# EAGLE design led (EAGLE 9.6.1)
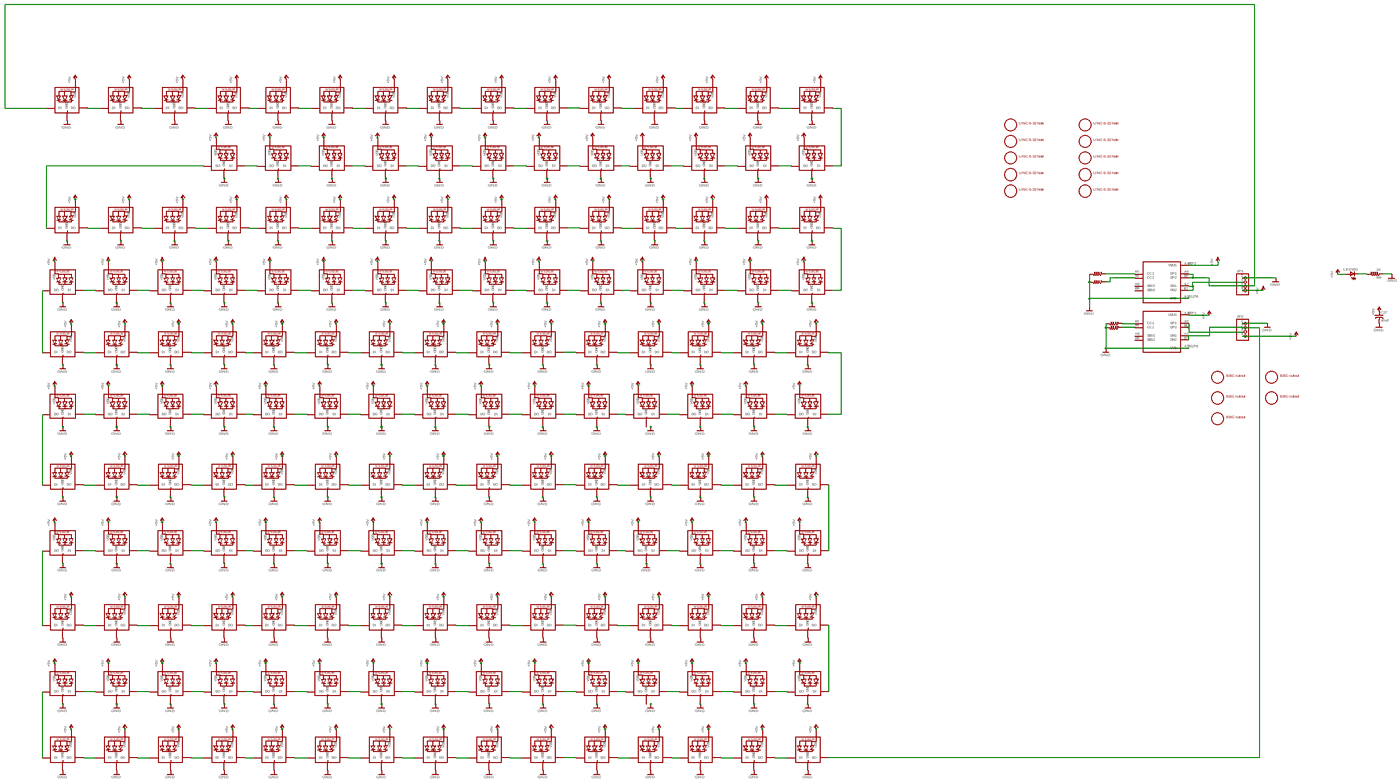
[diagram p0: schematic, sheet 1, overview]
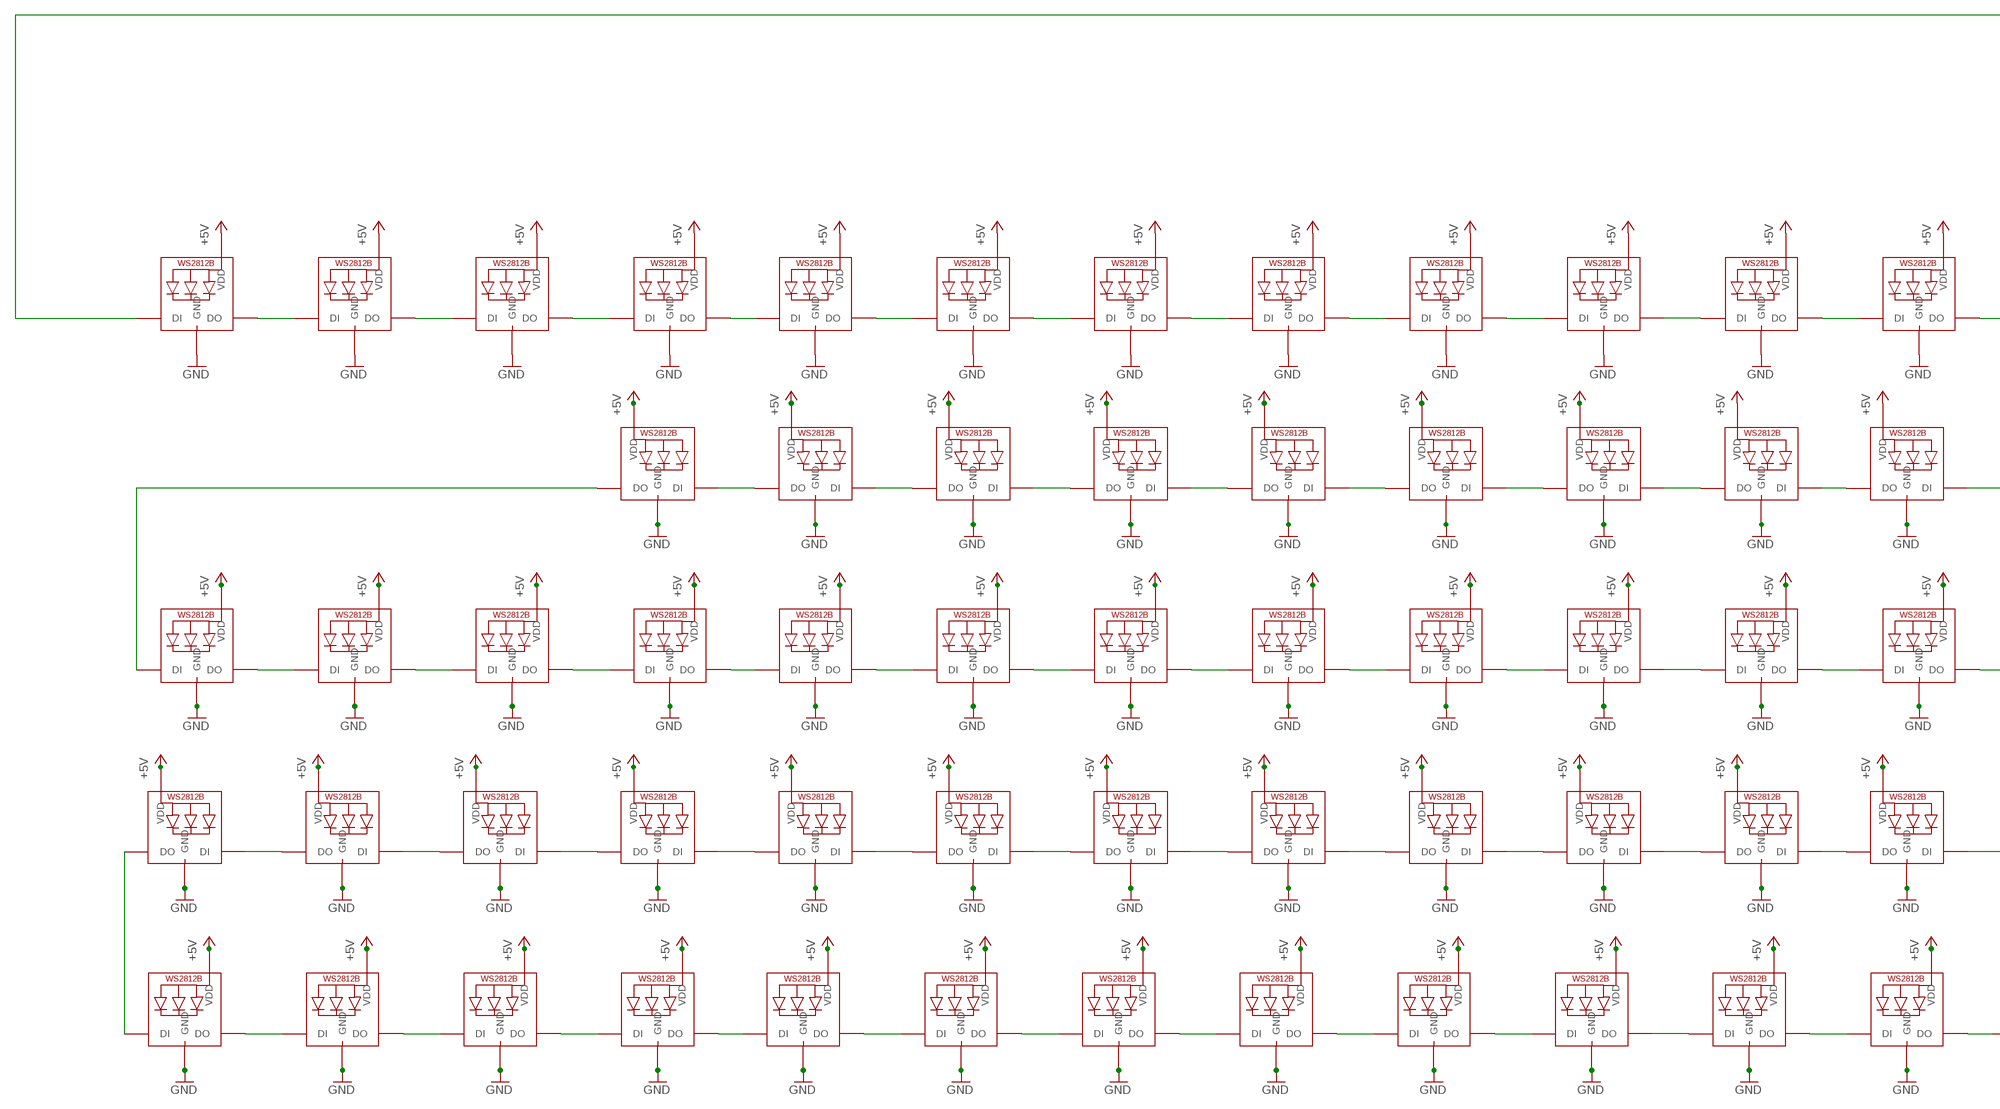
[diagram p1: schematic, sheet 1, part 1 of 4]
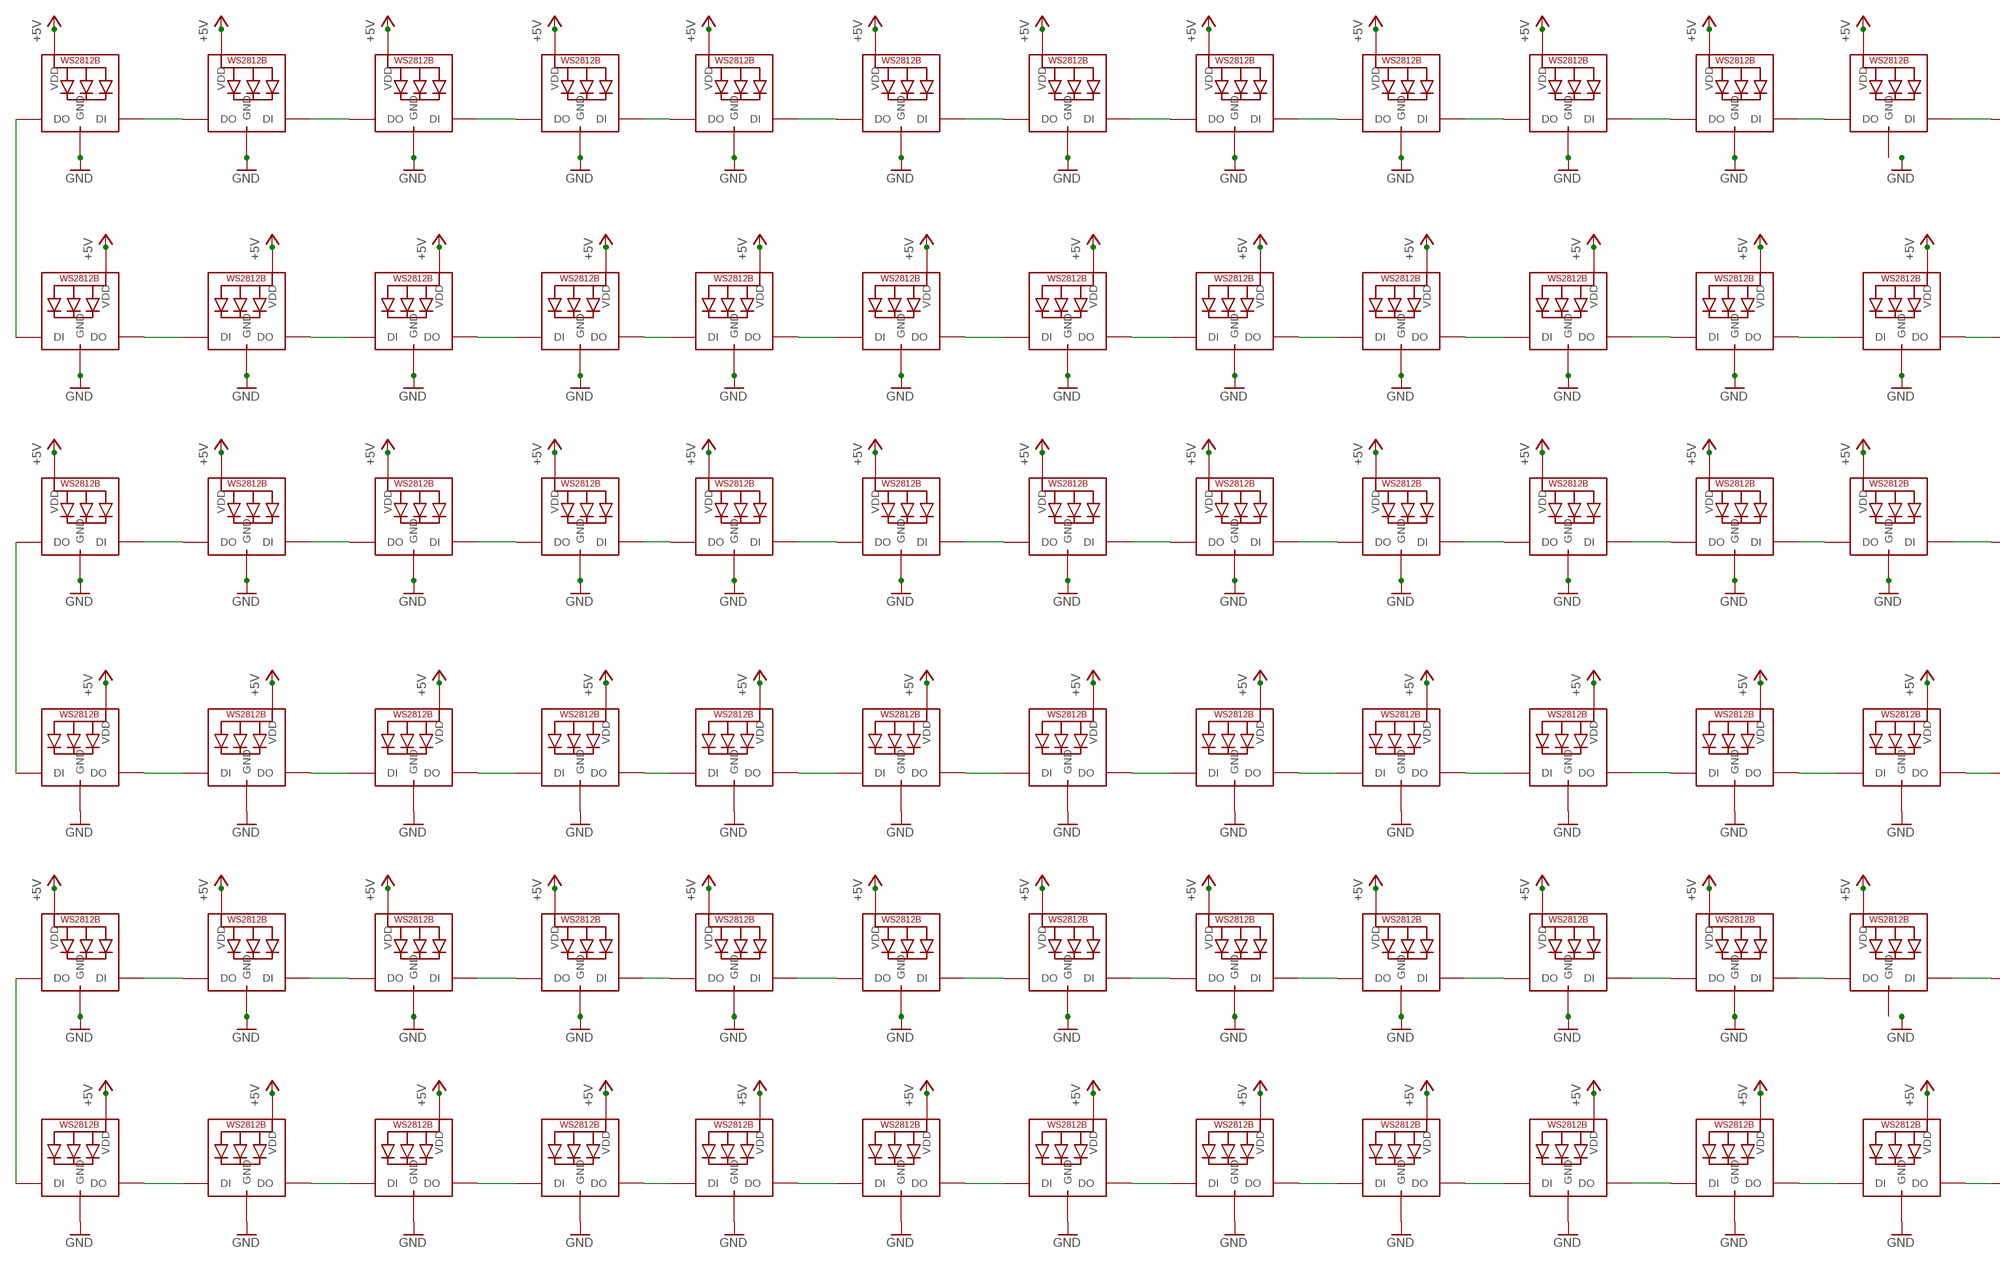
[diagram p2: schematic, sheet 1, part 2 of 4]
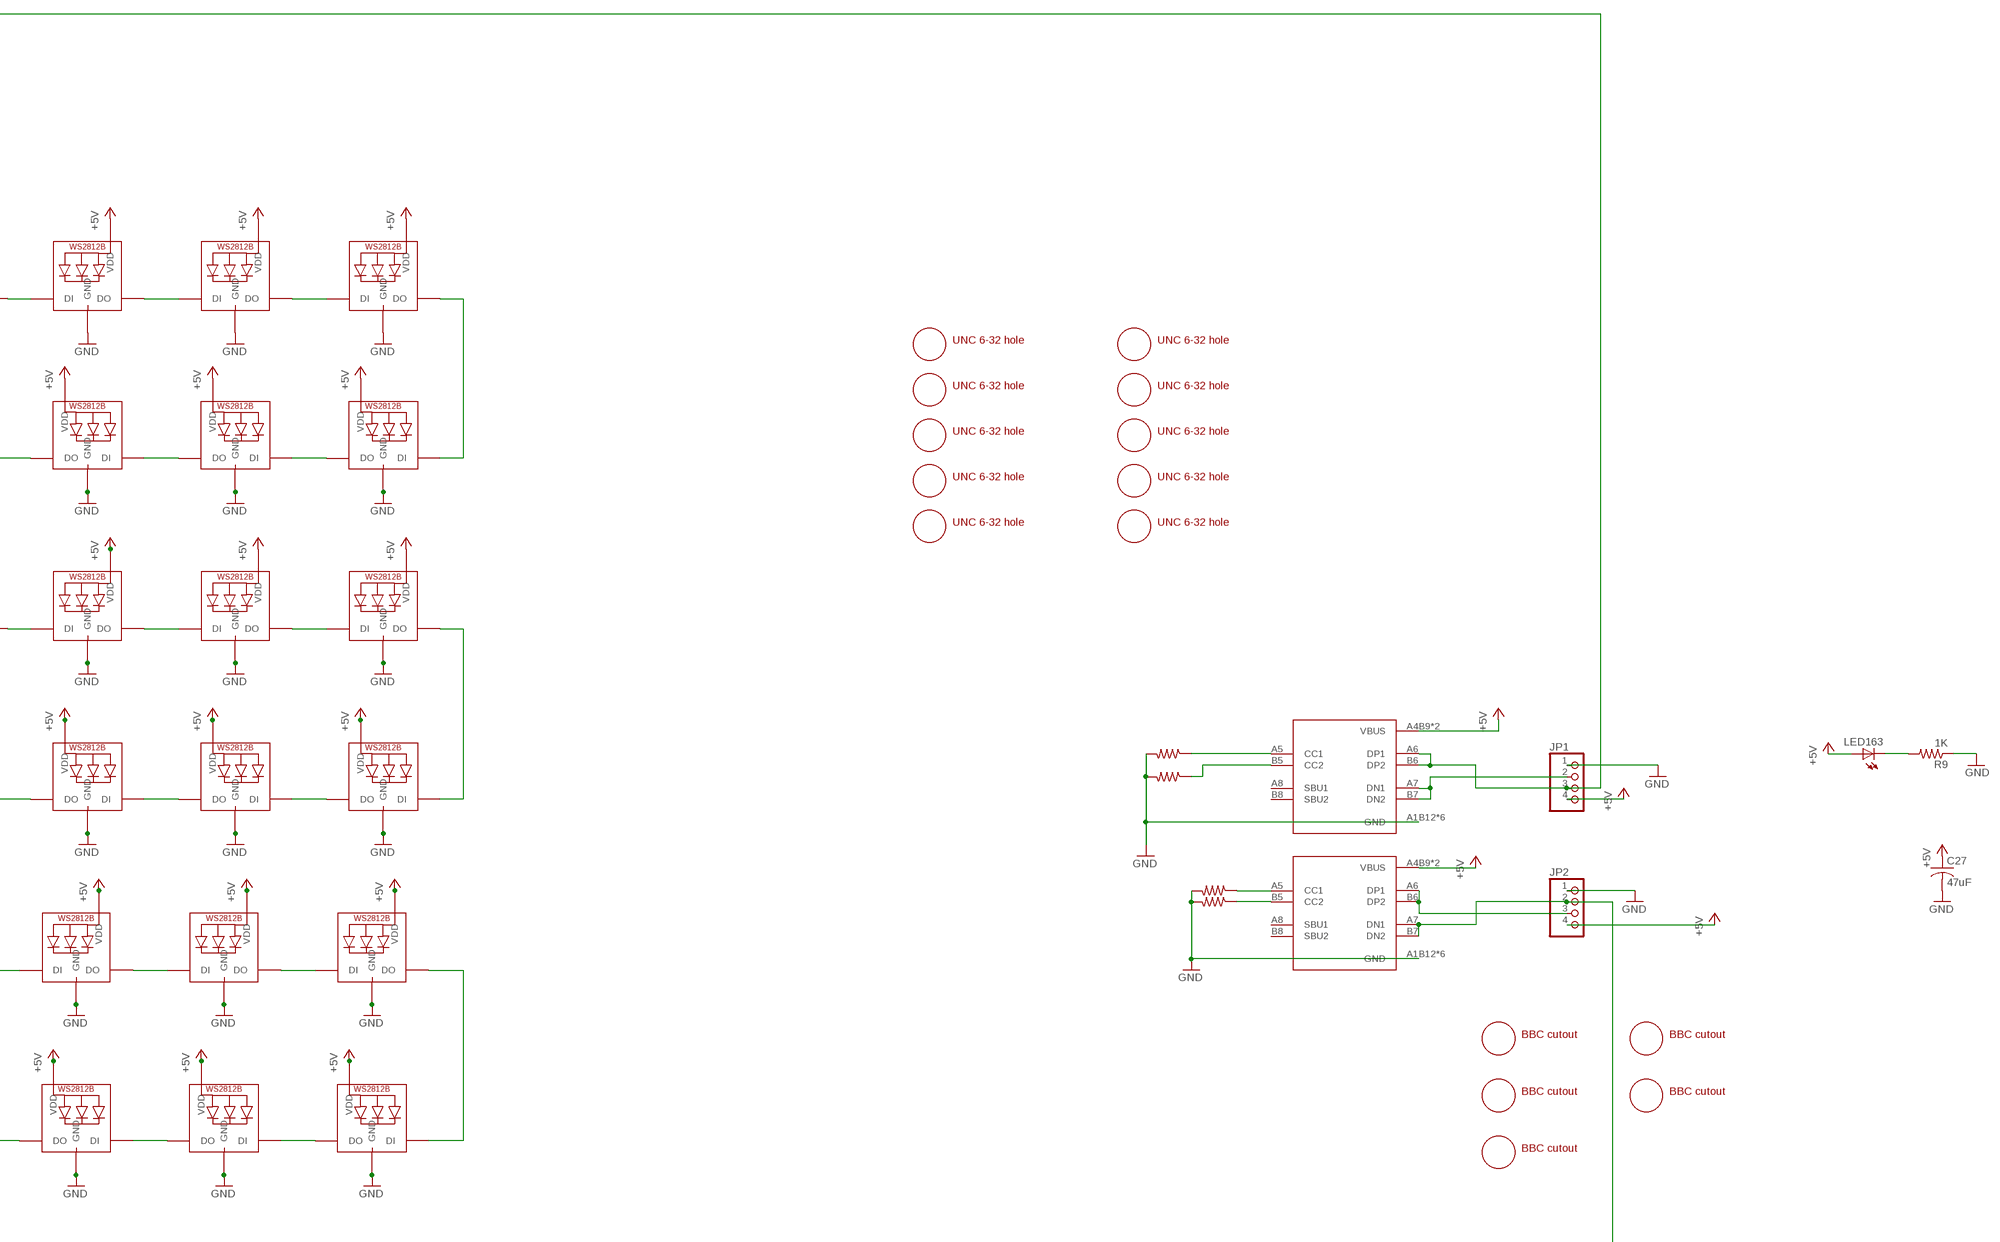
[diagram p3: schematic, sheet 1, part 3 of 4]
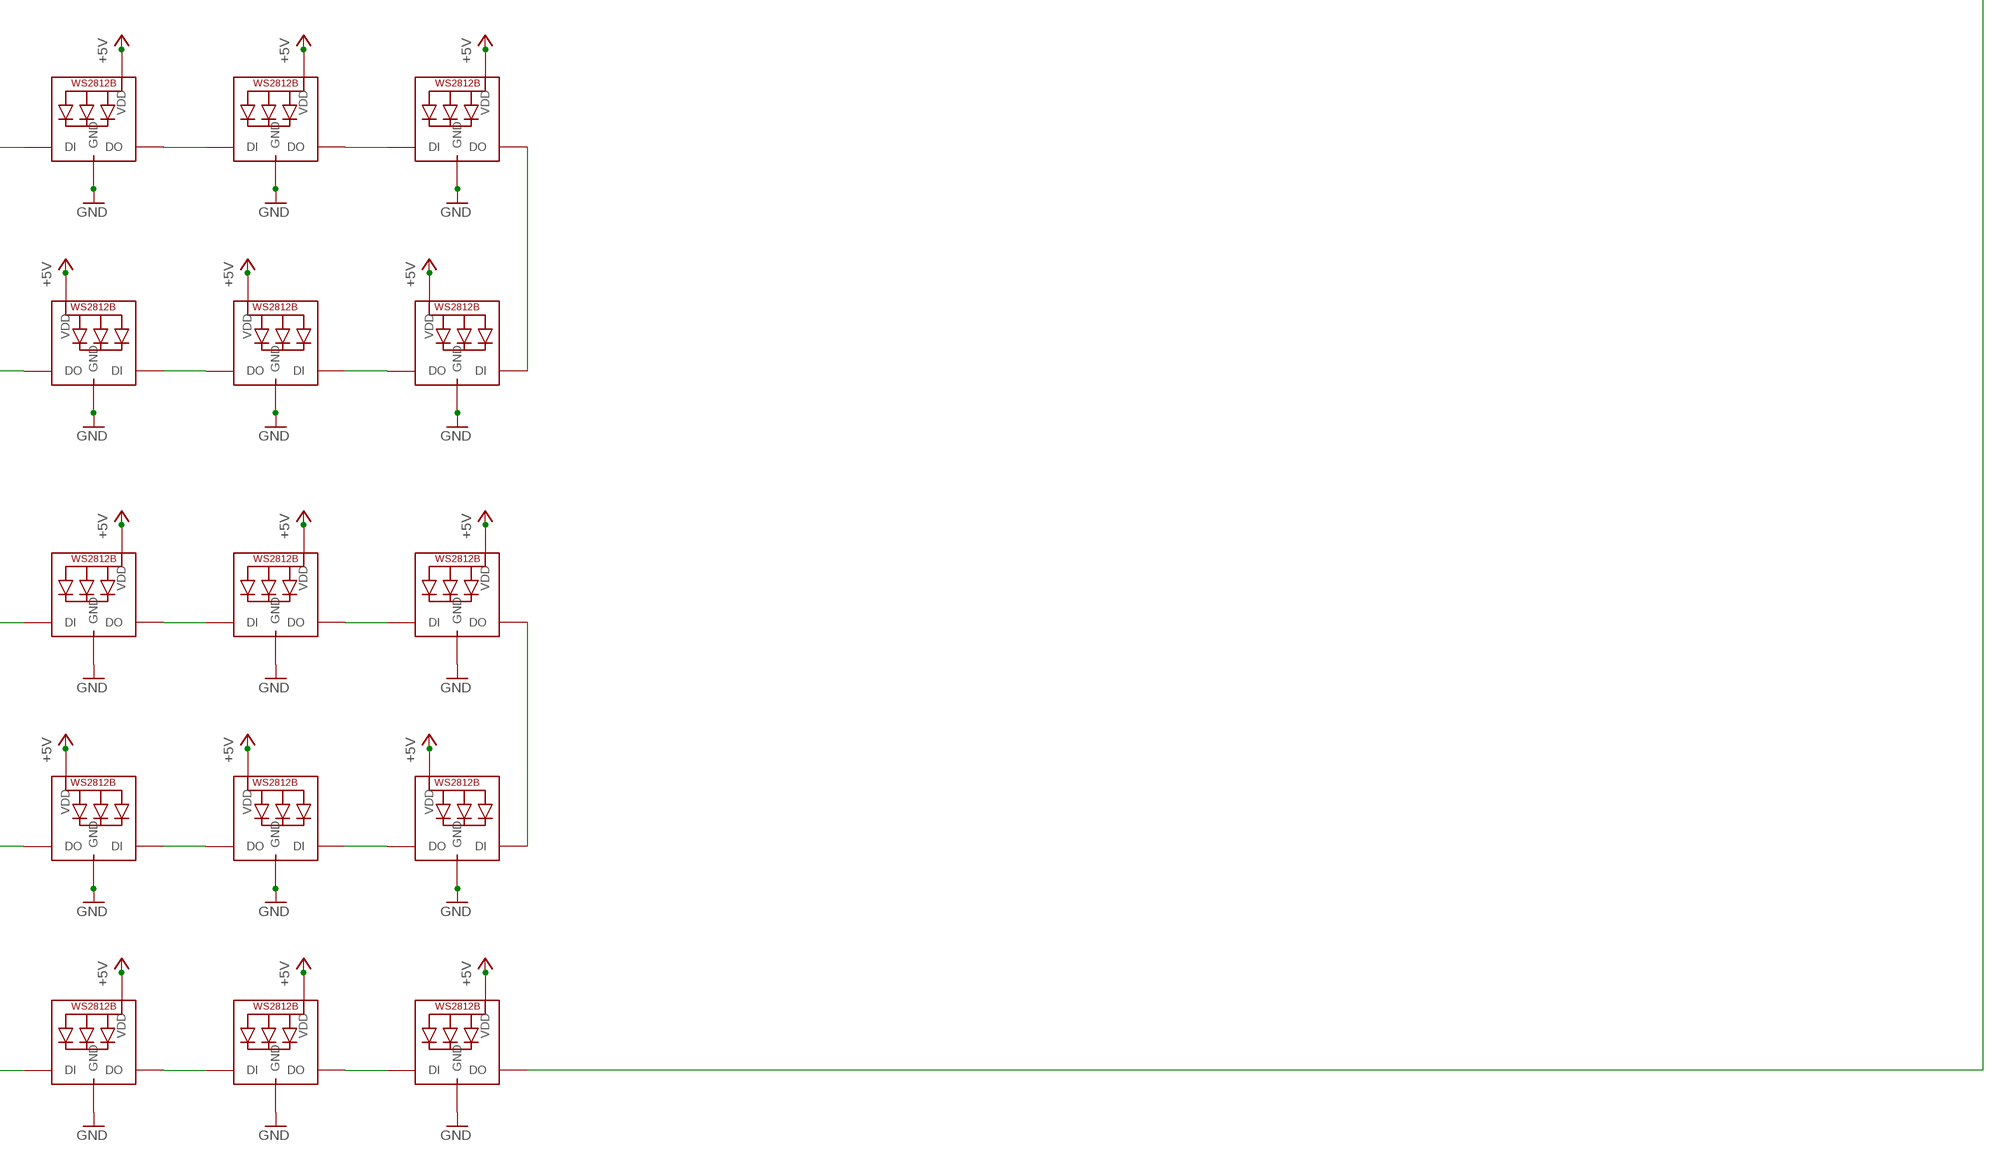
[diagram p4: schematic, sheet 1, part 4 of 4]

## Parts
C27  47uF  C-USC1210  [C1210]
JP1  PINHD-1X4  [1X04]
JP2  PINHD-1X4  [1X04]
LED1  WS2812B  [REVERSE_MNT]
LED2  WS2812B  [REVERSE_MNT]
LED3  WS2812B  [REVERSE_MNT]
LED4  WS2812B  [REVERSE_MNT]
LED5  WS2812B  [REVERSE_MNT]
LED6  WS2812B  [REVERSE_MNT]
LED7  WS2812B  [REVERSE_MNT]
LED8  WS2812B  [REVERSE_MNT]
LED9  WS2812B  [REVERSE_MNT]
LED10  WS2812B  [REVERSE_MNT]
LED11  WS2812B  [REVERSE_MNT]
LED12  WS2812B  [REVERSE_MNT]
LED13  WS2812B  [REVERSE_MNT]
LED14  WS2812B  [REVERSE_MNT]
LED15  WS2812B  [REVERSE_MNT]
LED16  WS2812B  [REVERSE_MNT]
LED17  WS2812B  [REVERSE_MNT]
LED18  WS2812B  [REVERSE_MNT]
LED19  WS2812B  [REVERSE_MNT]
LED20  WS2812B  [REVERSE_MNT]
LED21  WS2812B  [REVERSE_MNT]
LED22  WS2812B  [REVERSE_MNT]
LED23  WS2812B  [REVERSE_MNT]
LED24  WS2812B  [REVERSE_MNT]
LED25  WS2812B  [REVERSE_MNT]
LED26  WS2812B  [REVERSE_MNT]
LED27  WS2812B  [REVERSE_MNT]
LED28  WS2812B  [REVERSE_MNT]
LED29  WS2812B  [REVERSE_MNT]
LED30  WS2812B  [REVERSE_MNT]
LED31  WS2812B  [REVERSE_MNT]
LED32  WS2812B  [REVERSE_MNT]
LED33  WS2812B  [REVERSE_MNT]
LED34  WS2812B  [REVERSE_MNT]
LED35  WS2812B  [REVERSE_MNT]
LED36  WS2812B  [REVERSE_MNT]
LED37  WS2812B  [REVERSE_MNT]
LED38  WS2812B  [REVERSE_MNT]
LED39  WS2812B  [REVERSE_MNT]
LED40  WS2812B  [REVERSE_MNT]
LED41  WS2812B  [REVERSE_MNT]
LED42  WS2812B  [REVERSE_MNT]
LED43  WS2812B  [REVERSE_MNT]
LED44  WS2812B  [REVERSE_MNT]
LED45  WS2812B  [REVERSE_MNT]
LED46  WS2812B  [REVERSE_MNT]
LED47  WS2812B  [REVERSE_MNT]
LED48  WS2812B  [REVERSE_MNT]
LED49  WS2812B  [REVERSE_MNT]
LED50  WS2812B  [REVERSE_MNT]
LED51  WS2812B  [REVERSE_MNT]
LED52  WS2812B  [REVERSE_MNT]
LED53  WS2812B  [REVERSE_MNT]
LED54  WS2812B  [REVERSE_MNT]
LED55  WS2812B  [REVERSE_MNT]
LED56  WS2812B  [REVERSE_MNT]
LED57  WS2812B  [REVERSE_MNT]
LED58  WS2812B  [REVERSE_MNT]
LED59  WS2812B  [REVERSE_MNT]
LED60  WS2812B  [REVERSE_MNT]
LED61  WS2812B  [REVERSE_MNT]
LED62  WS2812B  [REVERSE_MNT]
LED63  WS2812B  [REVERSE_MNT]
LED64  WS2812B  [REVERSE_MNT]
LED65  WS2812B  [REVERSE_MNT]
LED66  WS2812B  [REVERSE_MNT]
LED67  WS2812B  [REVERSE_MNT]
LED68  WS2812B  [REVERSE_MNT]
LED69  WS2812B  [REVERSE_MNT]
LED70  WS2812B  [REVERSE_MNT]
LED71  WS2812B  [REVERSE_MNT]
LED72  WS2812B  [REVERSE_MNT]
LED73  WS2812B  [REVERSE_MNT]
LED74  WS2812B  [REVERSE_MNT]
LED75  WS2812B  [REVERSE_MNT]
LED76  WS2812B  [REVERSE_MNT]
LED77  WS2812B  [REVERSE_MNT]
LED78  WS2812B  [REVERSE_MNT]
LED79  WS2812B  [REVERSE_MNT]
LED80  WS2812B  [REVERSE_MNT]
LED81  WS2812B  [REVERSE_MNT]
LED82  WS2812B  [REVERSE_MNT]
LED83  WS2812B  [REVERSE_MNT]
LED84  WS2812B  [REVERSE_MNT]
LED85  WS2812B  [REVERSE_MNT]
LED86  WS2812B  [REVERSE_MNT]
LED87  WS2812B  [REVERSE_MNT]
LED88  WS2812B  [REVERSE_MNT]
LED89  WS2812B  [REVERSE_MNT]
LED90  WS2812B  [REVERSE_MNT]
LED91  WS2812B  [REVERSE_MNT]
LED92  WS2812B  [REVERSE_MNT]
LED93  WS2812B  [REVERSE_MNT]
LED94  WS2812B  [REVERSE_MNT]
LED95  WS2812B  [REVERSE_MNT]
LED96  WS2812B  [REVERSE_MNT]
LED97  WS2812B  [REVERSE_MNT]
LED98  WS2812B  [REVERSE_MNT]
LED99  WS2812B  [REVERSE_MNT]
LED100  WS2812B  [REVERSE_MNT]
LED101  WS2812B  [REVERSE_MNT]
LED102  WS2812B  [REVERSE_MNT]
LED103  WS2812B  [REVERSE_MNT]
LED104  WS2812B  [REVERSE_MNT]
LED105  WS2812B  [REVERSE_MNT]
LED106  WS2812B  [REVERSE_MNT]
LED107  WS2812B  [REVERSE_MNT]
LED108  WS2812B  [REVERSE_MNT]
LED109  WS2812B  [REVERSE_MNT]
LED110  WS2812B  [REVERSE_MNT]
LED111  WS2812B  [REVERSE_MNT]
LED112  WS2812B  [REVERSE_MNT]
LED113  WS2812B  [REVERSE_MNT]
LED114  WS2812B  [REVERSE_MNT]
LED115  WS2812B  [REVERSE_MNT]
LED116  WS2812B  [REVERSE_MNT]
LED117  WS2812B  [REVERSE_MNT]
LED118  WS2812B  [REVERSE_MNT]
LED119  WS2812B  [REVERSE_MNT]
LED120  WS2812B  [REVERSE_MNT]
LED121  WS2812B  [REVERSE_MNT]
LED122  WS2812B  [REVERSE_MNT]
LED123  WS2812B  [REVERSE_MNT]
LED124  WS2812B  [REVERSE_MNT]
LED125  WS2812B  [REVERSE_MNT]
LED126  WS2812B  [REVERSE_MNT]
LED127  WS2812B  [REVERSE_MNT]
LED128  WS2812B  [REVERSE_MNT]
LED129  WS2812B  [REVERSE_MNT]
LED130  WS2812B  [REVERSE_MNT]
LED131  WS2812B  [REVERSE_MNT]
LED132  WS2812B  [REVERSE_MNT]
LED133  WS2812B  [REVERSE_MNT]
LED134  WS2812B  [REVERSE_MNT]
LED135  WS2812B  [REVERSE_MNT]
LED136  WS2812B  [REVERSE_MNT]
LED137  WS2812B  [REVERSE_MNT]
LED138  WS2812B  [REVERSE_MNT]
LED139  WS2812B  [REVERSE_MNT]
LED140  WS2812B  [REVERSE_MNT]
LED141  WS2812B  [REVERSE_MNT]
LED142  WS2812B  [REVERSE_MNT]
LED143  WS2812B  [REVERSE_MNT]
LED144  WS2812B  [REVERSE_MNT]
LED145  WS2812B  [REVERSE_MNT]
LED146  WS2812B  [REVERSE_MNT]
LED147  WS2812B  [REVERSE_MNT]
LED148  WS2812B  [REVERSE_MNT]
LED149  WS2812B  [REVERSE_MNT]
LED150  WS2812B  [REVERSE_MNT]
LED151  WS2812B  [REVERSE_MNT]
LED152  WS2812B  [REVERSE_MNT]
LED153  WS2812B  [REVERSE_MNT]
LED154  WS2812B  [REVERSE_MNT]
LED155  WS2812B  [REVERSE_MNT]
LED156  WS2812B  [REVERSE_MNT]
LED157  WS2812B  [REVERSE_MNT]
LED158  WS2812B  [REVERSE_MNT]
LED159  WS2812B  [REVERSE_MNT]
LED160  WS2812B  [REVERSE_MNT]
LED161  WS2812B  [REVERSE_MNT]
LED162  WS2812B  [REVERSE_MNT]
LED163  LEDCHIP-LED0805  [CHIP-LED0805]
R1  5.1K  RESISTOR0805-RES  [0805]
R2  5.1K  RESISTOR0805-RES  [0805]
R3  5.1K  RESISTOR0805-RES  [0805]
R4  5.1K  RESISTOR0805-RES  [0805]
R9  1K  RESISTOR0805-RES  [0805]
U1  USBC_16P  [USBC_16P_FOOT]
U2  USBC_16P  [USBC_16P_FOOT]
U$1  MOTHERBOARD_MOUNTING_HOLE  [MOTEHRBOARD_MOUNTING_HOLE]
U$2  MOTHERBOARD_MOUNTING_HOLE  [MOTEHRBOARD_MOUNTING_HOLE]
U$3  MOTHERBOARD_MOUNTING_HOLE  [MOTEHRBOARD_MOUNTING_HOLE]
U$4  MOTHERBOARD_MOUNTING_HOLE  [MOTEHRBOARD_MOUNTING_HOLE]
U$5  MOTHERBOARD_MOUNTING_HOLE  [MOTEHRBOARD_MOUNTING_HOLE]
U$6  MOTHERBOARD_MOUNTING_HOLE  [MOTEHRBOARD_MOUNTING_HOLE]
U$7  MOTHERBOARD_MOUNTING_HOLE  [MOTEHRBOARD_MOUNTING_HOLE]
U$8  MOTHERBOARD_MOUNTING_HOLE  [MOTEHRBOARD_MOUNTING_HOLE]
U$9  MOTHERBOARD_MOUNTING_HOLE  [MOTEHRBOARD_MOUNTING_HOLE]
U$10  MOTHERBOARD_MOUNTING_HOLE  [MOTEHRBOARD_MOUNTING_HOLE]
U$11  BBC_CUTOUT  [BBC_MOUNTING_HOLE_CUTOUT]
U$12  BBC_CUTOUT  [BBC_MOUNTING_HOLE_CUTOUT]
U$13  BBC_CUTOUT  [BBC_MOUNTING_HOLE_CUTOUT]
U$14  BBC_CUTOUT  [BBC_MOUNTING_HOLE_CUTOUT]
U$15  BBC_CUTOUT  [BBC_MOUNTING_HOLE_CUTOUT]

## Nets
+5V: C27.1 JP1.4 JP2.4 LED1.VDD LED2.VDD LED3.VDD LED4.VDD LED5.VDD LED6.VDD LED7.VDD LED8.VDD LED9.VDD LED10.VDD LED11.VDD LED12.VDD LED13.VDD LED14.VDD LED15.VDD LED16.VDD LED17.VDD LED18.VDD LED19.VDD LED20.VDD LED21.VDD LED22.VDD LED23.VDD LED24.VDD LED25.VDD LED26.VDD LED27.VDD LED28.VDD LED29.VDD LED30.VDD LED31.VDD LED32.VDD LED33.VDD LED34.VDD LED35.VDD LED36.VDD LED37.VDD LED38.VDD LED39.VDD LED40.VDD LED41.VDD LED42.VDD LED43.VDD LED44.VDD LED45.VDD LED46.VDD LED47.VDD LED48.VDD LED49.VDD LED50.VDD LED51.VDD LED52.VDD LED53.VDD LED54.VDD LED55.VDD LED56.VDD LED57.VDD LED58.VDD LED59.VDD LED60.VDD LED61.VDD LED62.VDD LED63.VDD LED64.VDD LED65.VDD LED66.VDD LED67.VDD LED68.VDD LED69.VDD LED70.VDD LED71.VDD LED72.VDD LED73.VDD LED74.VDD LED75.VDD LED76.VDD LED77.VDD LED78.VDD LED79.VDD LED80.VDD LED81.VDD LED82.VDD LED83.VDD LED84.VDD LED85.VDD LED86.VDD LED87.VDD LED88.VDD LED89.VDD LED90.VDD LED91.VDD LED92.VDD LED93.VDD LED94.VDD LED95.VDD LED96.VDD LED97.VDD LED98.VDD LED99.VDD LED100.VDD LED101.VDD LED102.VDD LED103.VDD LED104.VDD LED105.VDD LED106.VDD LED107.VDD LED108.VDD LED109.VDD LED110.VDD LED111.VDD LED112.VDD LED113.VDD LED114.VDD LED115.VDD LED116.VDD LED117.VDD LED118.VDD LED119.VDD LED120.VDD LED121.VDD LED122.VDD LED123.VDD LED124.VDD LED125.VDD LED126.VDD LED127.VDD LED128.VDD LED129.VDD LED130.VDD LED131.VDD LED132.VDD LED133.VDD LED134.VDD LED135.VDD LED136.VDD LED137.VDD LED138.VDD LED139.VDD LED140.VDD LED141.VDD LED142.VDD LED143.VDD LED144.VDD LED145.VDD LED146.VDD LED147.VDD LED148.VDD LED149.VDD LED150.VDD LED151.VDD LED152.VDD LED153.VDD LED154.VDD LED155.VDD LED156.VDD LED157.VDD LED158.VDD LED159.VDD LED160.VDD LED161.VDD LED162.VDD LED163.A U1.A4B9(VBUS) U1.B4A9(VBUS) U2.A4B9(VBUS) U2.B4A9(VBUS)
GND: C27.2 JP1.1 JP2.1 LED1.GND LED2.GND LED3.GND LED4.GND LED5.GND LED6.GND LED7.GND LED8.GND LED9.GND LED10.GND LED11.GND LED12.GND LED13.GND LED14.GND LED15.GND LED16.GND LED17.GND LED18.GND LED19.GND LED20.GND LED21.GND LED22.GND LED23.GND LED24.GND LED25.GND LED26.GND LED27.GND LED28.GND LED29.GND LED30.GND LED31.GND LED32.GND LED33.GND LED34.GND LED35.GND LED36.GND LED37.GND LED38.GND LED39.GND LED40.GND LED41.GND LED42.GND LED43.GND LED44.GND LED45.GND LED46.GND LED47.GND LED48.GND LED49.GND LED50.GND LED51.GND LED52.GND LED53.GND LED54.GND LED55.GND LED56.GND LED57.GND LED58.GND LED59.GND LED60.GND LED61.GND LED62.GND LED63.GND LED64.GND LED65.GND LED66.GND LED67.GND LED68.GND LED69.GND LED70.GND LED71.GND LED72.GND LED73.GND LED74.GND LED75.GND LED77.GND LED78.GND LED79.GND LED80.GND LED81.GND LED82.GND LED83.GND LED84.GND LED85.GND LED86.GND LED87.GND LED88.GND LED89.GND LED90.GND LED91.GND LED92.GND LED93.GND LED94.GND LED95.GND LED96.GND LED97.GND LED98.GND LED99.GND LED100.GND LED101.GND LED102.GND LED103.GND LED104.GND LED105.GND LED106.GND LED107.GND LED108.GND LED109.GND LED110.GND LED111.GND LED112.GND LED113.GND LED114.GND LED115.GND LED116.GND LED117.GND LED118.GND LED119.GND LED120.GND LED121.GND LED122.GND LED123.GND LED124.GND LED125.GND LED126.GND LED127.GND LED128.GND LED129.GND LED130.GND LED131.GND LED132.GND LED133.GND LED134.GND LED135.GND LED137.GND LED138.GND LED139.GND LED140.GND LED141.GND LED142.GND LED143.GND LED144.GND LED145.GND LED146.GND LED147.GND LED148.GND LED149.GND LED150.GND LED151.GND LED152.GND LED153.GND LED154.GND LED155.GND LED156.GND LED157.GND LED158.GND LED159.GND LED160.GND LED161.GND LED162.GND R1.2 R2.2 R3.2 R4.2 R9.1 U1.A1B12(GND) U1.B11A12(GND) U1.P$13(GND) U1.P$14(GND) U1.P$15(GND) U1.P$16(GND) U2.A1B12(GND) U2.B11A12(GND) U2.P$13(GND) U2.P$14(GND) U2.P$15(GND) U2.P$16(GND)
N$1: LED1.DOUT(DO) LED2.DIN(DI)
N$2: LED2.DOUT(DO) LED3.DIN(DI)
N$3: LED3.DOUT(DO) LED4.DIN(DI)
N$4: LED4.DOUT(DO) LED5.DIN(DI)
N$5: LED5.DOUT(DO) LED6.DIN(DI)
N$6: LED6.DOUT(DO) LED7.DIN(DI)
N$7: R3.1 U1.A5(CC1)
N$8: LED8.DOUT(DO) LED9.DIN(DI)
N$9: LED9.DOUT(DO) LED10.DIN(DI)
N$10: LED10.DOUT(DO) LED11.DIN(DI)
N$11: LED11.DOUT(DO) LED12.DIN(DI)
N$12: LED12.DOUT(DO) LED13.DIN(DI)
N$13: LED13.DOUT(DO) LED14.DIN(DI)
N$14: LED14.DOUT(DO) LED15.DIN(DI)
N$15: LED15.DOUT(DO) LED16.DIN(DI)
N$16: LED16.DOUT(DO) LED17.DIN(DI)
N$17: LED17.DOUT(DO) LED18.DIN(DI)
N$18: LED18.DOUT(DO) LED19.DIN(DI)
N$19: LED19.DOUT(DO) LED20.DIN(DI)
N$20: LED20.DOUT(DO) LED21.DIN(DI)
N$21: LED21.DOUT(DO) LED22.DIN(DI)
N$22: LED22.DOUT(DO) LED23.DIN(DI)
N$23: LED23.DOUT(DO) LED24.DIN(DI)
N$24: LED24.DOUT(DO) LED25.DIN(DI)
N$25: LED25.DOUT(DO) LED26.DIN(DI)
N$26: LED26.DOUT(DO) LED27.DIN(DI)
N$27: LED28.DOUT(DO) LED29.DIN(DI)
N$28: LED29.DOUT(DO) LED30.DIN(DI)
N$29: LED30.DOUT(DO) LED31.DIN(DI)
N$30: LED31.DOUT(DO) LED32.DIN(DI)
N$31: R1.1 U2.B5(CC2)
N$32: LED32.DOUT(DO) LED33.DIN(DI)
N$33: R2.1 U2.A5(CC1)
N$34: LED33.DOUT(DO) LED34.DIN(DI)
N$35: LED34.DOUT(DO) LED35.DIN(DI)
N$36: LED35.DOUT(DO) LED36.DIN(DI)
N$37: LED36.DOUT(DO) LED37.DIN(DI)
N$38: LED37.DOUT(DO) LED38.DIN(DI)
N$39: LED38.DOUT(DO) LED39.DIN(DI)
N$40: LED39.DOUT(DO) LED40.DIN(DI)
N$41: LED40.DOUT(DO) LED41.DIN(DI)
N$42: LED41.DOUT(DO) LED42.DIN(DI)
N$43: LED42.DOUT(DO) LED43.DIN(DI)
N$44: LED27.DOUT(DO) LED28.DIN(DI)
N$45: LED54.DOUT(DO) LED55.DIN(DI)
N$46: LED43.DOUT(DO) LED44.DIN(DI)
N$47: LED44.DOUT(DO) LED45.DIN(DI)
N$48: LED45.DOUT(DO) LED46.DIN(DI)
N$49: LED46.DOUT(DO) LED47.DIN(DI)
N$50: LED47.DOUT(DO) LED48.DIN(DI)
N$51: LED48.DOUT(DO) LED49.DIN(DI)
N$52: LED49.DOUT(DO) LED50.DIN(DI)
N$53: LED50.DOUT(DO) LED51.DIN(DI)
N$54: LED51.DOUT(DO) LED52.DIN(DI)
N$55: LED52.DOUT(DO) LED53.DIN(DI)
N$56: LED53.DOUT(DO) LED54.DIN(DI)
N$57: LED55.DOUT(DO) LED56.DIN(DI)
N$58: LED56.DOUT(DO) LED57.DIN(DI)
N$59: LED58.DOUT(DO) LED59.DIN(DI)
N$60: LED59.DOUT(DO) LED60.DIN(DI)
N$61: LED60.DOUT(DO) LED61.DIN(DI)
N$62: LED61.DOUT(DO) LED62.DIN(DI)
N$63: LED62.DOUT(DO) LED63.DIN(DI)
N$64: LED63.DOUT(DO) LED64.DIN(DI)
N$65: LED64.DOUT(DO) LED65.DIN(DI)
N$66: LED65.DOUT(DO) LED66.DIN(DI)
N$67: LED66.DOUT(DO) LED67.DIN(DI)
N$68: LED67.DOUT(DO) LED68.DIN(DI)
N$69: LED68.DOUT(DO) LED69.DIN(DI)
N$70: LED69.DOUT(DO) LED70.DIN(DI)
N$71: LED70.DOUT(DO) LED71.DIN(DI)
N$72: LED71.DOUT(DO) LED72.DIN(DI)
N$73: LED57.DOUT(DO) LED58.DIN(DI)
N$74: LED73.DOUT(DO) LED74.DIN(DI)
N$75: LED74.DOUT(DO) LED75.DIN(DI)
N$76: LED75.DOUT(DO) LED76.DIN(DI)
N$77: LED76.DOUT(DO) LED77.DIN(DI)
N$78: LED77.DOUT(DO) LED78.DIN(DI)
N$79: LED78.DOUT(DO) LED79.DIN(DI)
N$80: LED79.DOUT(DO) LED80.DIN(DI)
N$81: LED80.DOUT(DO) LED81.DIN(DI)
N$82: LED81.DOUT(DO) LED82.DIN(DI)
N$83: LED82.DOUT(DO) LED83.DIN(DI)
N$84: LED83.DOUT(DO) LED84.DIN(DI)
N$85: LED84.DOUT(DO) LED85.DIN(DI)
N$86: LED85.DOUT(DO) LED86.DIN(DI)
N$87: LED86.DOUT(DO) LED87.DIN(DI)
N$88: LED72.DOUT(DO) LED73.DIN(DI)
N$89: LED88.DOUT(DO) LED89.DIN(DI)
N$90: LED89.DOUT(DO) LED90.DIN(DI)
N$91: LED90.DOUT(DO) LED91.DIN(DI)
N$92: LED91.DOUT(DO) LED92.DIN(DI)
N$93: LED92.DOUT(DO) LED93.DIN(DI)
N$94: LED93.DOUT(DO) LED94.DIN(DI)
N$95: LED94.DOUT(DO) LED95.DIN(DI)
N$96: LED95.DOUT(DO) LED96.DIN(DI)
N$97: LED96.DOUT(DO) LED97.DIN(DI)
N$98: LED97.DOUT(DO) LED98.DIN(DI)
N$99: LED98.DOUT(DO) LED99.DIN(DI)
N$100: LED99.DOUT(DO) LED100.DIN(DI)
N$101: LED100.DOUT(DO) LED101.DIN(DI)
N$102: LED101.DOUT(DO) LED102.DIN(DI)
N$103: LED87.DOUT(DO) LED88.DIN(DI)
N$104: LED103.DOUT(DO) LED104.DIN(DI)
N$105: LED104.DOUT(DO) LED105.DIN(DI)
N$106: LED105.DOUT(DO) LED106.DIN(DI)
N$107: LED106.DOUT(DO) LED107.DIN(DI)
N$108: LED107.DOUT(DO) LED108.DIN(DI)
N$109: LED108.DOUT(DO) LED109.DIN(DI)
N$110: LED109.DOUT(DO) LED110.DIN(DI)
N$111: LED110.DOUT(DO) LED111.DIN(DI)
N$112: LED111.DOUT(DO) LED112.DIN(DI)
N$113: LED112.DOUT(DO) LED113.DIN(DI)
N$114: LED113.DOUT(DO) LED114.DIN(DI)
N$115: LED114.DOUT(DO) LED115.DIN(DI)
N$116: LED115.DOUT(DO) LED116.DIN(DI)
N$117: LED116.DOUT(DO) LED117.DIN(DI)
N$118: LED102.DOUT(DO) LED103.DIN(DI)
N$119: LED118.DOUT(DO) LED119.DIN(DI)
N$120: LED119.DOUT(DO) LED120.DIN(DI)
N$121: LED120.DOUT(DO) LED121.DIN(DI)
N$122: LED121.DOUT(DO) LED122.DIN(DI)
N$123: LED122.DOUT(DO) LED123.DIN(DI)
N$124: LED123.DOUT(DO) LED124.DIN(DI)
N$125: LED124.DOUT(DO) LED125.DIN(DI)
N$126: LED125.DOUT(DO) LED126.DIN(DI)
N$127: LED126.DOUT(DO) LED127.DIN(DI)
N$128: LED127.DOUT(DO) LED128.DIN(DI)
N$129: LED128.DOUT(DO) LED129.DIN(DI)
N$130: LED129.DOUT(DO) LED130.DIN(DI)
N$131: LED130.DOUT(DO) LED131.DIN(DI)
N$132: LED131.DOUT(DO) LED132.DIN(DI)
N$133: LED117.DOUT(DO) LED118.DIN(DI)
N$134: LED133.DOUT(DO) LED134.DIN(DI)
N$135: LED134.DOUT(DO) LED135.DIN(DI)
N$136: LED135.DOUT(DO) LED136.DIN(DI)
N$137: LED136.DOUT(DO) LED137.DIN(DI)
N$138: LED137.DOUT(DO) LED138.DIN(DI)
N$139: LED138.DOUT(DO) LED139.DIN(DI)
N$140: LED139.DOUT(DO) LED140.DIN(DI)
N$141: LED140.DOUT(DO) LED141.DIN(DI)
N$142: LED141.DOUT(DO) LED142.DIN(DI)
N$143: LED142.DOUT(DO) LED143.DIN(DI)
N$144: LED143.DOUT(DO) LED144.DIN(DI)
N$145: LED144.DOUT(DO) LED145.DIN(DI)
N$146: LED145.DOUT(DO) LED146.DIN(DI)
N$147: LED146.DOUT(DO) LED147.DIN(DI)
N$148: LED132.DOUT(DO) LED133.DIN(DI)
N$149: LED148.DOUT(DO) LED149.DIN(DI)
N$150: LED149.DOUT(DO) LED150.DIN(DI)
N$151: LED150.DOUT(DO) LED151.DIN(DI)
N$152: LED151.DOUT(DO) LED152.DIN(DI)
N$153: LED152.DOUT(DO) LED153.DIN(DI)
N$154: LED153.DOUT(DO) LED154.DIN(DI)
N$155: LED154.DOUT(DO) LED155.DIN(DI)
N$156: LED155.DOUT(DO) LED156.DIN(DI)
N$157: LED156.DOUT(DO) LED157.DIN(DI)
N$158: LED157.DOUT(DO) LED158.DIN(DI)
N$159: LED158.DOUT(DO) LED159.DIN(DI)
N$160: LED159.DOUT(DO) LED160.DIN(DI)
N$161: LED160.DOUT(DO) LED161.DIN(DI)
N$162: LED161.DOUT(DO) LED162.DIN(DI)
N$163: LED147.DOUT(DO) LED148.DIN(DI)
N$164: R4.1 U1.B5(CC2)
N$165: JP1.3 LED1.DIN(DI) U2.A6(DP1) U2.B6(DP2)
N$166: JP1.2 U2.A7(DN1) U2.B7(DN2)
N$167: JP2.3 U1.A6(DP1) U1.B6(DP2)
N$168: JP2.2 LED162.DOUT(DO) U1.A7(DN1) U1.B7(DN2)
N$169: LED7.DOUT(DO) LED8.DIN(DI)
N$170: LED163.C R9.2
Unconnected: U1.A8(SBU1) U1.B8(SBU2) U2.A8(SBU1) U2.B8(SBU2)

## Power pins joined to a net without a drawn wire
GND: LED76.GND LED136.GND

## Library data of the parts
C27 = clock:C-US: CAPACITOR, American symbol
JP1 JP2 = pinhead:PINHD-1X4: PIN HEADER
LED1-LED162 = led:WS2812B
LED163 = adafruit:LED: LED OSRAM: - CHIPLED LG R971, LG N971, LY N971, LG Q971, LY Q971, LO R971, LY R971 LH N974, LH R974 LS Q976, LO Q976, LY Q976 LO Q996 - Hyper CHIPLED LW Q18S LB Q993, LB Q99A, LB R99A - SideLED LS A670, LO A670, LY A670, LG A670, LP A670 LB A673, LV A673, LT A673, LW A673 LH A674 LY A675 LS A676, LA A676, LO A676, LY A676, LW A676 LS A679, LY A679, LG A679 - Hyper Micro SIDELED® LS Y876, LA Y876, LO Y876, LY Y876 LT Y87S - SmartLED LW L88C, LW L88S LB L89C, LB L89S, LG L890 LS L89K, LO L89K, LY L89K LS L896, LA L896, LO L896, LY L896 - TOPLED LS T670, LO T670, LY T670, LG T670, LP T670 LSG T670, LSP T670, LSY T670, LOP T670, LYG T670 LG T671, LOG T671, LSG T671 LB T673, LV T673, LT T673, LW T673 LH T674 LS T676, LA T676, LO T676, LY T676, LB T676, LH T676, LSB T676, LW T676 LB T67C, LV T67C, LT T67C, LS T67K, LO T67K, LY T67K, LW E67C LS E67B, LA E67B, LO E67B, LY E67B, LB E67C, LV E67C, LT E67C LW T67C LS T679, LY T679, LG T679 LS T770, LO T770, LY T770, LG T770, LP T770 LB T773, LV T773, LT T773, LW T773 LH T774 LS E675, LA E675, LY E675, LS T675 LS T776, LA T776, LO T776, LY T776, LB T776 LHGB T686 LT T68C, LB T68C - Hyper Mini TOPLED® LB M676 - Mini TOPLED Santana® LG M470 LS M47K, LO M47K, LY M47K Source: http://www.osram.convergy.de/
R1-R4 = joyAnalog:RESISTOR: Resistor Basic schematic elements and footprints for 0603, 1206, and PTH resistors.
R9 = SparkFun-Passives:RESISTOR: Resistor Basic schematic elements and footprints for 0603, 1206, and PTH resistors.
U1 U2 = my_usbc_16p:USBC_16P
U$1-U$10 = led:MOTHERBOARD_MOUNTING_HOLE
U$11-U$15 = led:BBC_CUTOUT

## Board
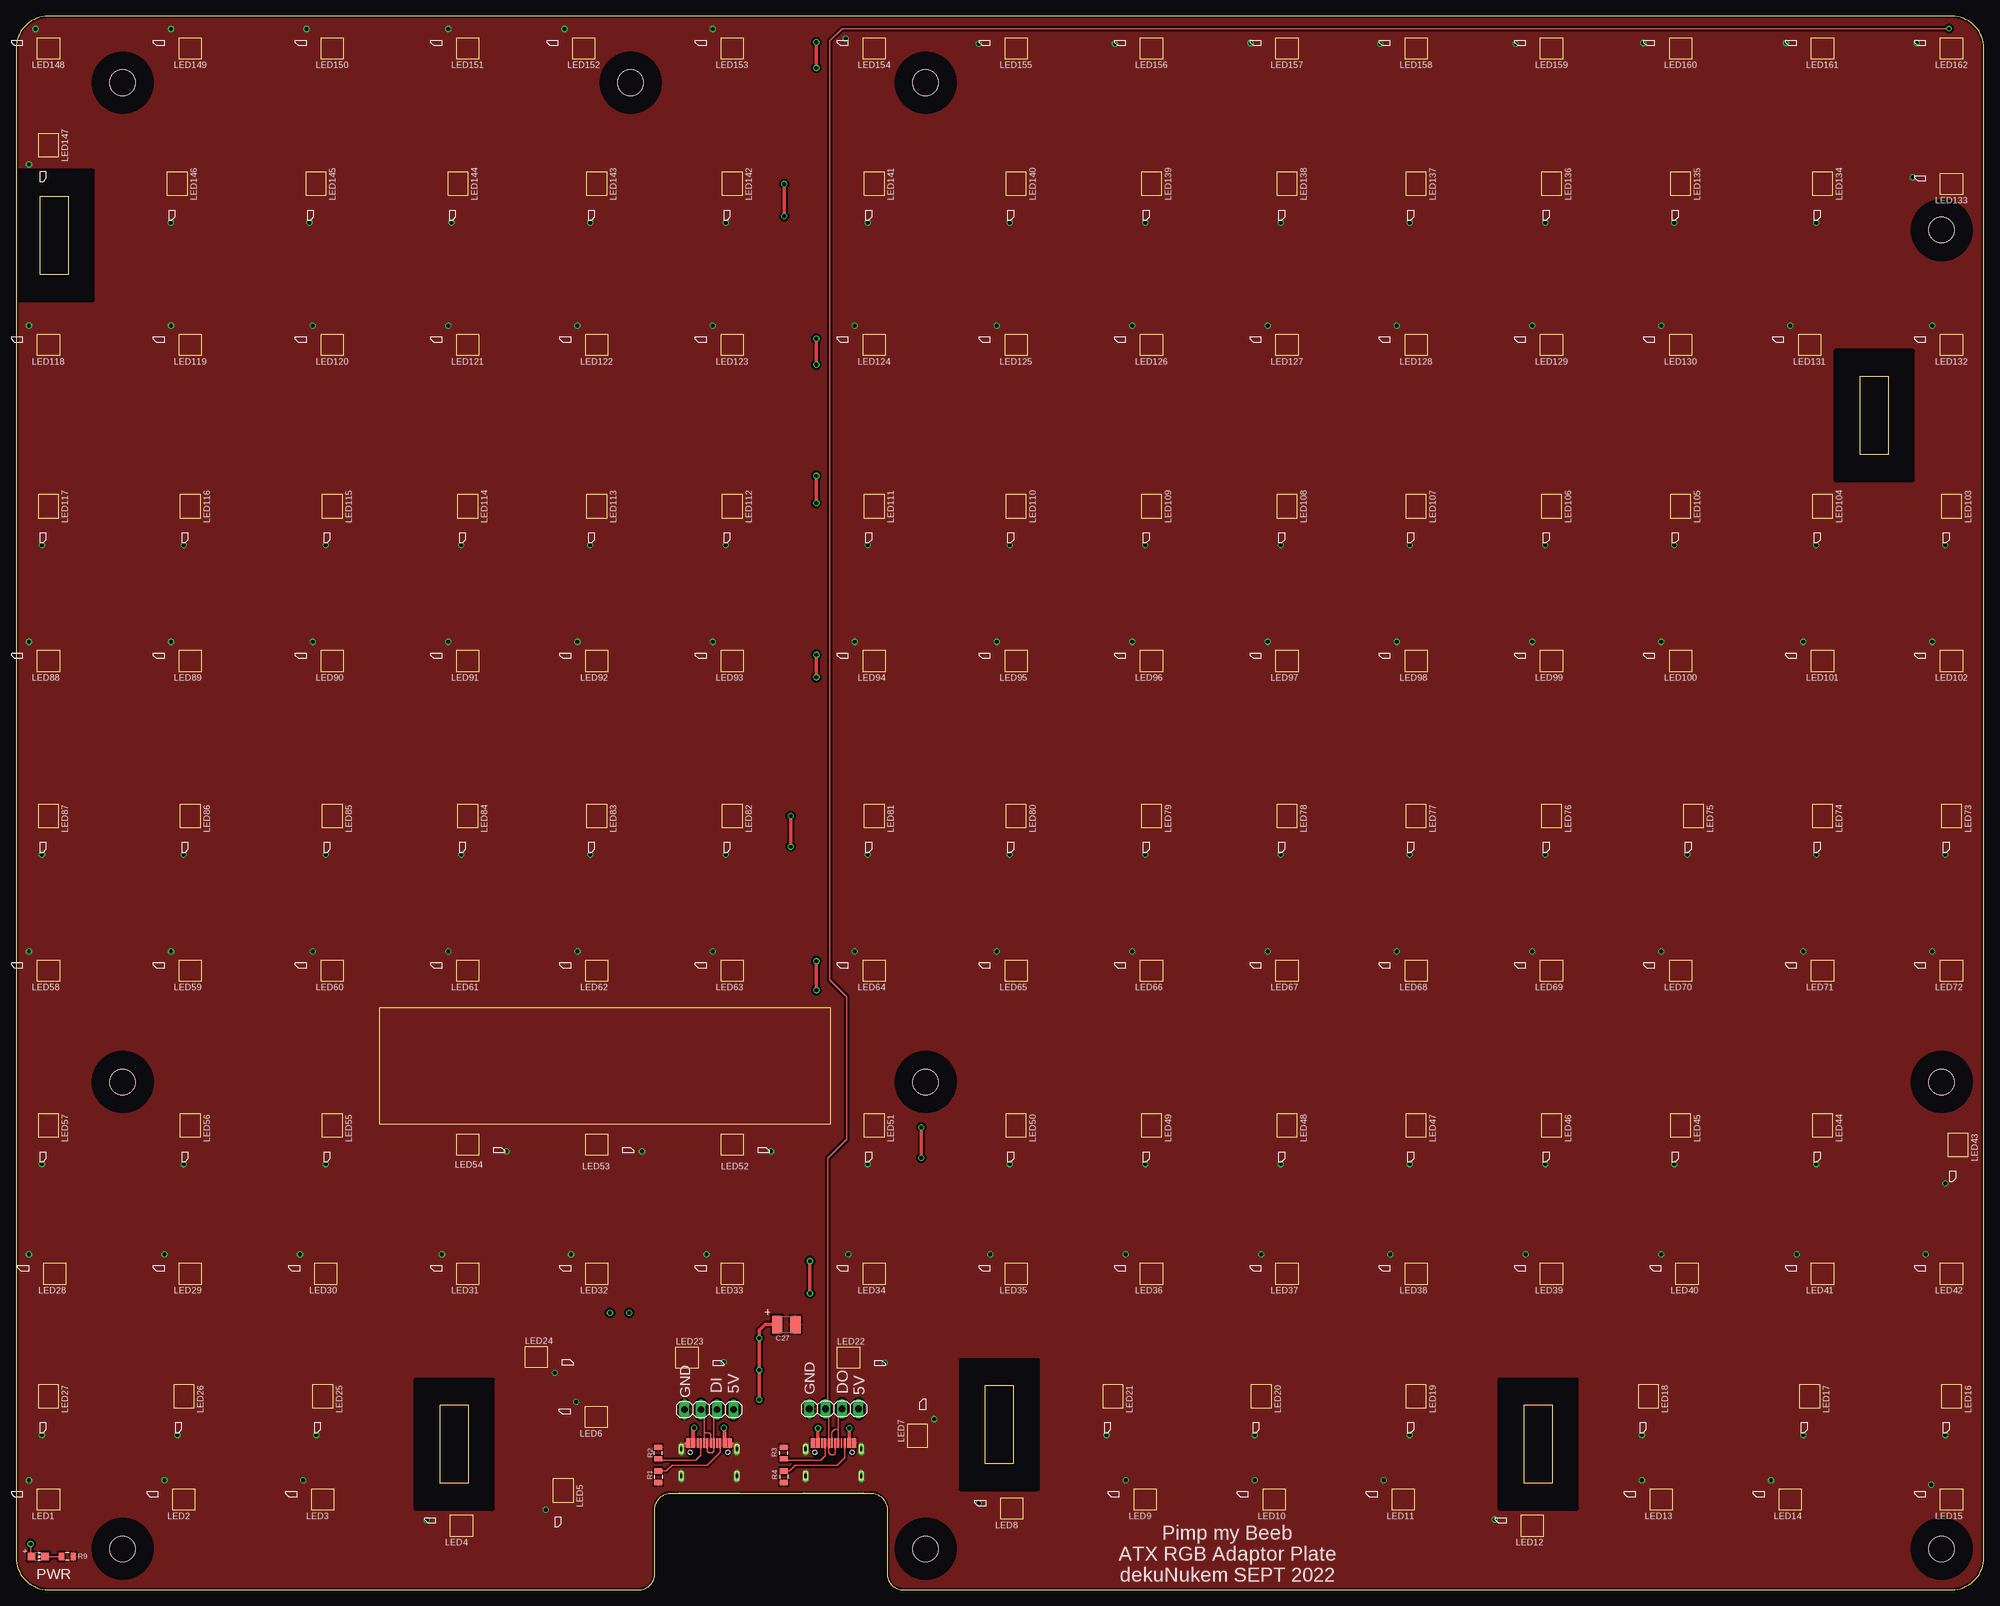
[diagram p5: board, top side]
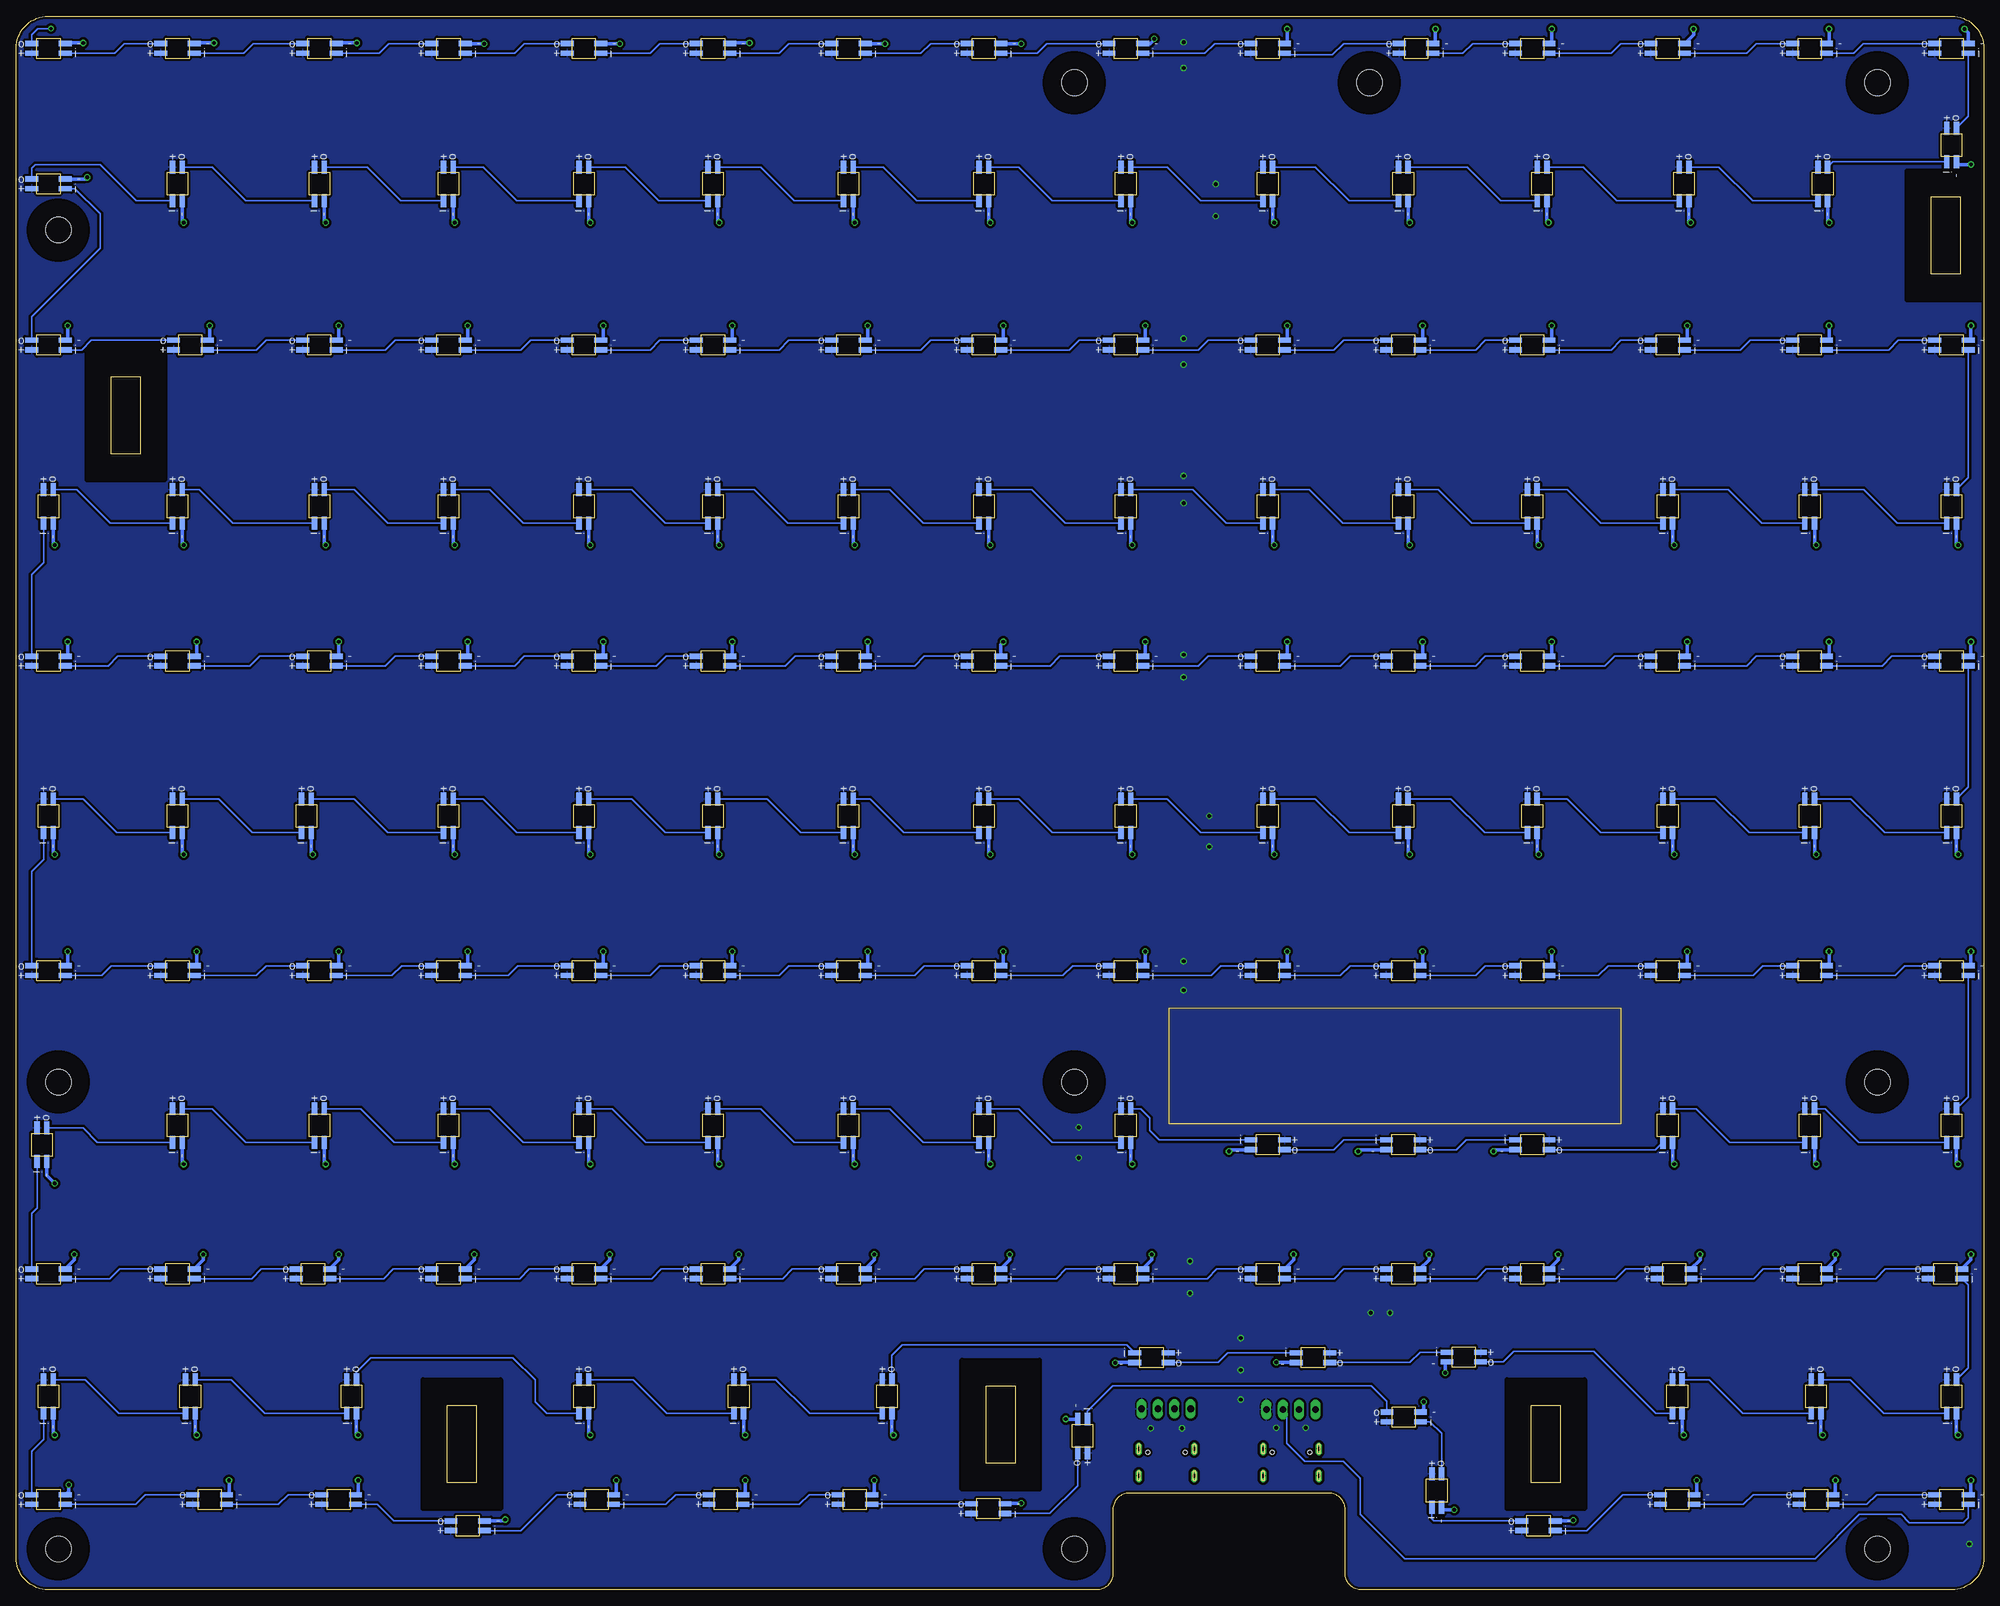
[diagram p6: board, bottom side, seen from below]

Size 305 x 244 mm. Coordinates in mm from the lower left corner, seen from the top.
Outline: 300,0 arc90 305,5 305,239 arc90 300,244 5,244 arc90 0,239 0,5 arc90 5,0 96.46,0 arc90 99,2.54 99,12.46 arc-90 101.54,15 132.46,15 arc-90 135,12.46 135,2.54 arc90 137.54,0 300,0
Copper layers (1*16): Top 0.035mm / dielectric 1.5mm / Bottom 0.035mm
Design rules "deku_2layer_6mil": minimum track width 6mil, minimum drill 15mil, track to track 6mil, track to pad 6mil, pad to pad 6mil, via to via 6mil, smd to smd 6mil, copper to edge 10mil, drill to drill 6mil, minimum pad ring 7mil, minimum via ring 7mil, stop-mask expansion 4mil, vias tented up to drill 25mil, thermal gap 10mil
Milling: area 56.3,72.3 to 126.3,90.3

### Footprints (pad centres in the part's own frame; a part is rotated, then mirrored left to right if it is on the bottom)
C1210 = smd 1.6 x 2.7: 1 -1.4,0; 2 1.4,0
1X04 = drill 1.016 long: 1 -3.81,0; 2 -1.27,0; 3 1.27,0; 4 3.81,0
REVERSE_MNT = smd 2 x 0.82 bottom: DIN -2.6,-0.75; DOUT 2.6,0.75; GND -2.6,0.75; VDD 2.6,-0.75
CHIP-LED0805 = smd 1.2 x 1.2: A 0,-1.05; C 0,1.05
0805 = smd 0.8 x 1.2: 1 -0.9,0; 2 0.9,0
USBC_16P_FOOT = smd 0.6 x 1.45: A1B12 -3.225,3.848; A4B9 -2.425,3.848; B4A9 2.425,3.848; B11A12 3.225,3.848 | smd 0.3 x 1.45: A5 -1.25,3.848; A6 -0.25,3.848; A7 0.25,3.848; A8 1.25,3.848; B5 1.75,3.848; B6 0.75,3.848; B7 -0.75,3.848; B8 -1.75,3.848 | drill 0.6 pad 1 long: P$13 -4.32,2.933; P$14 4.32,2.933; P$15 -4.32,-1.248; P$16 4.32,-1.248 | hole 0.65: -2.89,2.402; 2.89,2.402
MOTEHRBOARD_MOUNTING_HOLE = hole 4: 0,0

### Placement (x,y rotation side)
C27  119.38,41.15 0 top
JP1  107.4,27.96 0 top
JP2  126.75,28.07 0 top
LED1  5,14 0 top
LED2  26,14 0 top
LED3  47.52,14 0 top
LED4  69.05,9.94 0 top
LED5  84.81,15.39 90 top
LED6  89.92,26.8 0 top
LED7  139.7,23.88 270 top
LED8  154.32,12.59 0 top
LED9  175,14 0 top
LED10  195,14 0 top
LED11  215,14 0 top
LED12  235,9.94 0 top
LED13  255,14 0 top
LED14  275,14 0 top
LED15  300,14 0 top
LED16  300,30 90 top
LED17  278,30 90 top
LED18  253,30 90 top
LED19  217,30 90 top
LED20  193,30 90 top
LED21  170,30 90 top
LED22  129,36 180 top
LED23  104,36 180 top
LED24  80.62,36.09 180 top
LED25  47.52,30 90 top
LED26  26,30 90 top
LED27  5,30 90 top
LED28  6,49 0 top
LED29  27,49 0 top
LED30  48,49 0 top
LED31  70,49 0 top
LED32  90,49 0 top
LED33  111,49 0 top
LED34  133,49 0 top
LED35  155,49 0 top
LED36  176,49 0 top
LED37  197,49 0 top
LED38  217,49 0 top
LED39  238,49 0 top
LED40  259,49 0 top
LED41  280,49 0 top
LED42  300,49 0 top
LED43  301,69 90 top
LED44  280,72 90 top
LED45  258,72 90 top
LED46  238,72 90 top
LED47  217,72 90 top
LED48  197,72 90 top
LED49  176,72 90 top
LED50  155,72 90 top
LED51  133,72 90 top
LED52  111,69 180 top
LED53  90,69 180 top
LED54  70,69 180 top
LED55  49,72 90 top
LED56  27,72 90 top
LED57  5,72 90 top
LED58  5,96 0 top
LED59  27,96 0 top
LED60  49,96 0 top
LED61  70,96 0 top
LED62  90,96 0 top
LED63  111,96 0 top
LED64  133,96 0 top
LED65  155,96 0 top
LED66  176,96 0 top
LED67  197,96 0 top
LED68  217,96 0 top
LED69  238,96 0 top
LED70  258,96 0 top
LED71  280,96 0 top
LED72  300,96 0 top
LED73  300,120 90 top
LED74  280,120 90 top
LED75  260,120 90 top
LED76  238,120 90 top
LED77  217,120 90 top
LED78  197,120 90 top
LED79  176,120 90 top
LED80  155,120 90 top
LED81  133,120 90 top
LED82  111,120 90 top
LED83  90,120 90 top
LED84  70,120 90 top
LED85  49,120 90 top
LED86  27,120 90 top
LED87  5,120 90 top
LED88  5,144 0 top
LED89  27,144 0 top
LED90  49,144 0 top
LED91  70,144 0 top
LED92  90,144 0 top
LED93  111,144 0 top
LED94  133,144 0 top
LED95  155,144 0 top
LED96  176,144 0 top
LED97  197,144 0 top
LED98  217,144 0 top
LED99  238,144 0 top
LED100  258,144 0 top
LED101  280,144 0 top
LED102  300,144 0 top
LED103  300,168 90 top
LED104  280,168 90 top
LED105  258,168 90 top
LED106  238,168 90 top
LED107  217,168 90 top
LED108  197,168 90 top
LED109  176,168 90 top
LED110  155,168 90 top
LED111  133,168 90 top
LED112  111,168 90 top
LED113  90,168 90 top
LED114  70,168 90 top
LED115  49,168 90 top
LED116  27,168 90 top
LED117  5,168 90 top
LED118  5,193 0 top
LED119  27,193 0 top
LED120  49,193 0 top
LED121  70,193 0 top
LED122  90,193 0 top
LED123  111,193 0 top
LED124  133,193 0 top
LED125  155,193 0 top
LED126  176,193 0 top
LED127  197,193 0 top
LED128  217,193 0 top
LED129  238,193 0 top
LED130  258,193 0 top
LED131  278,193 0 top
LED132  300,193 0 top
LED133  300,218 0 top
LED134  280,218 90 top
LED135  258,218 90 top
LED136  238,218 90 top
LED137  217,218 90 top
LED138  197,218 90 top
LED139  176,218 90 top
LED140  155,218 90 top
LED141  133,218 90 top
LED142  111,218 90 top
LED143  90,218 90 top
LED144  68.48,218 90 top
LED145  46.46,218 90 top
LED146  24.97,218 90 top
LED147  5,224 90 top
LED148  5,239 0 top
LED149  27,239 0 top
LED150  49,239 0 top
LED151  70,239 0 top
LED152  88,239 0 top
LED153  111,239 0 top
LED154  133,239 0 top
LED155  155,239 0 top
LED156  176,239 0 top
LED157  197,239 0 top
LED158  217,239 0 top
LED159  238,239 0 top
LED160  258,239 0 top
LED161  280,239 0 top
LED162  300,239 0 top
LED163  3.43,5.16 270 top
R1  99.52,17.53 270 top
R2  99.52,21.21 90 top
R3  119,21.21 90 top
R4  119,17.53 270 top
R9  7.94,5.16 180 top
U1  126.68,18.92 0 top
U2  107.4,18.92 0 top
U$1  16.51,233.68 0 top
U$2  140.97,6.35 0 top
U$3  298.45,6.35 0 top
U$4  16.51,6.35 0 top
U$5  16.51,78.74 0 top
U$6  140.97,78.74 0 top
U$7  298.45,78.74 0 top
U$8  95.25,233.68 0 top
U$9  140.97,233.68 0 top
U$10  298.45,210.82 0 top
U$11  5.9,210 0 top
U$12  67.9,22.6 0 top
U$13  152.4,25.6 0 top
U$14  235.9,22.6 0 top
U$15  288,182.1 0 top

### Tracks (layer width: path | path; a pad name or v marks a point on that pad's centre or on a via)
+5V  (via drill 0.6)
  Top 0.254: v2.24,7.11 2.24,5.3 LED163.A
  Top 0.508: v123.05,50.97 v123.05,45.97 | v140.32,71.7 v140.32,66.97 | v124.05,97.46 v124.05,92.97 | v120.05,119.97 v120.05,115.22 | v124.05,144.97 v124.05,141.48 | v124.05,172.72 v124.05,168.48 | v124.05,193.97 v124.05,189.97 | v119.05,217.97 v119.05,212.97 | v124.05,239.97 v124.05,235.97 | v129.11,25.02 U1.B4A9 | U1.A4B9 124.26,24.99 v124.29,25.02 | v115.17,29.51 v115.17,34.08 v115.17,39.03 115.17,40.24 116.08,41.15 C27.1
  Top 0.61: U2.A4B9 104.97,25.01 v105.11,25.15 | U2.B4A9 109.82,25.01 v109.68,25.15
  other vias: 95.05,42.97 92.05,42.97
  pour Bottom (isolate 0.381): 305,5 305,239 arc90 300,244 5,244 arc90 0,239 0,5 arc90 5,0 300,0 arc90
GND  (via drill 0.6)
  Top 0.61: U2.A1B12 103.99,22.77 U2.P$13 | U2.B11A12 110.8,22.77 U2.P$14
  Bottom 0.508: v2,17 2,15.15 LED1.GND | LED27.GND 4.25,24.25 v4,24 | LED26.GND 25.25,24.25 v25,24 | v23,17 23,15.15 LED2.GND | v44.52,17 44.52,15.15 LED3.GND | LED25.GND 46.77,24.25 v46.52,24 | LED4.GND 63.73,10.69 v63.63,10.78 | v172,17 172,15.15 LED9.GND | LED21.GND 169.25,24.25 v169,24 | LED20.GND 192.25,24.25 v192,24 | v192,17 192,15.15 LED10.GND | v212,17 212,15.15 LED11.GND | v252,17 252,15.15 LED13.GND | v252,24 252.25,24.25 LED18.GND | LED17.GND 277.25,24.25 v277,24 | v272,17 272,15.15 LED14.GND | LED16.GND 299.25,24.25 v299,24 | LED43.GND 300.25,64.25 v299,63 | v296,52 296,51.15 LED42.GND | LED44.GND 279.25,66.25 v279,66 | v276,52 276,51.15 LED41.GND | v255,52 255,51.15 LED40.GND | LED45.GND 257.25,66.25 v257,66 | LED46.GND 237.25,66.25 v237,66 | v234,52 234,51.15 LED39.GND | v213,52 213,51.15 LED38.GND | LED47.GND 216.25,66.25 v216,66 | LED48.GND 196.25,66.25 v196,66 | v193,52 193,51.15 LED37.GND | v172,52 172,51.15 LED36.GND | LED49.GND 175.25,66.25 v175,66 | LED50.GND 154.25,66.25 v154,66 | v151,52 151,51.15 LED35.GND | LED51.GND 132.25,66.25 v132,66 | v129,52 129,51.15 LED34.GND | LED52.GND 116.75,68.25 v117,68 | LED33.GND 107,51.15 v107,52 | LED32.GND 86,51.15 v86,52 | LED53.GND 96.75,68.25 v97,68 | LED54.GND 75.75,68.25 v76,68 | LED31.GND 66,51.15 v66,52 | LED30.GND 44,51.15 v44,52 | LED55.GND 48.25,66.25 v48,66 | LED56.GND 26.25,66.25 v26,66 | LED29.GND 23,51.15 v23,52 | LED57.GND 4.25,66.25 v4,66 | LED28.GND 2,51.15 v2,52 | v2,99 2,97.15 LED58.GND | LED87.GND 4.25,114.25 v4,114 | LED59.GND 24,97.15 v24,99 | LED86.GND 26.25,114.25 v26,114 | LED85.GND 48.25,114.25 v48,114 | LED84.GND 69.25,114.25 v69,114 | LED60.GND 46,97.15 v46,99 | LED61.GND 67,97.15 v67,99
  Bottom 0.508: LED83.GND 89.25,114.25 v89,114 | LED82.GND 110.25,114.25 v110,114 | LED81.GND 132.25,114.25 v132,114 | LED80.GND 154.25,114.25 v154,114 | LED79.GND 175.25,114.25 v175,114 | LED66.GND 173,97.15 v173,99 | LED65.GND 152,97.15 v152,99 | LED64.GND 130,97.15 v130,99 | LED63.GND 108,97.15 v108,99 | LED62.GND 87,97.15 v87,99 | LED78.GND 196.25,114.25 v196,114 | LED77.GND 216.25,114.25 v216,114 | LED76.GND 237.25,114.25 v237,114 | LED75.GND 259.25,114.25 v259,114 | LED74.GND 279.25,114.25 v279,114 | LED73.GND 299.25,114.25 v299,114 | LED67.GND 194,97.15 v194,99 | LED68.GND 214,97.15 v214,99 | LED69.GND 235,97.15 v235,99 | LED70.GND 255,97.15 v255,99 | LED71.GND 277,97.15 v277,99 | LED72.GND 297,97.15 v297,99 | LED118.GND 2,194.15 v2,196 | LED119.GND 24,194.15 v24,196 | LED120.GND 46,194.15 v46,196 | LED121.GND 67,194.15 v67,196 | LED122.GND 87,194.15 v87,196 | LED123.GND 108,194.15 v108,196 | LED112.GND 110.25,162.25 v110,162 | LED113.GND 89.25,162.25 v89,162 | LED114.GND 69.25,162.25 v69,162 | LED115.GND 48.25,162.25 v48,162 | LED116.GND 26.25,162.25 v26,162 | LED117.GND 4.25,162.25 v4,162 | LED88.GND 2,145.15 v2,147 | LED89.GND 24,145.15 v24,147 | LED90.GND 46,145.15 v46,147 | LED91.GND 67,145.15 v67,147 | LED92.GND 87,145.15 v87,147 | LED93.GND 108,145.15 v108,147 | LED124.GND 130,194.15 v130,196 | LED125.GND 152,194.15 v152,196 | LED126.GND 173,194.15 v173,196 | LED127.GND 194,194.15 v194,196 | LED128.GND 214,194.15 v214,196 | LED129.GND 235,194.15 v235,196 | LED111.GND 132.25,162.25 v132,162 | LED110.GND 154.25,162.25 v154,162 | LED109.GND 175.25,162.25 v175,162 | LED108.GND 196.25,162.25 v196,162 | LED107.GND 216.25,162.25 v216,162
  Bottom 0.508: LED106.GND 237.25,162.25 v237,162 | LED94.GND 130,145.15 v130,147 | LED95.GND 152.4,146.6 v152,147 | LED96.GND 173,145.15 v173,147 | LED97.GND 194,145.15 v194,147 | LED98.GND 214,145.15 v214,147 | LED99.GND 235,145.15 v235,147 | LED130.GND 255,194.15 v255,196 | LED131.GND 275,194.15 v275,196 | LED132.GND 297,194.15 v297,196 | LED105.GND 257.25,162.25 v257,162 | LED100.GND 255,145.15 v255,147 | LED104.GND 279.25,162.25 v279,162 | LED103.GND 299.25,162.25 v299,162 | LED101.GND 277,145.15 v277,147 | LED102.GND 297,145.15 v297,147 | LED162.GND 297.31,239.84 v294.59,239.84 | LED161.GND 277.31,239.84 v274.33,239.84 | LED160.GND 255.31,239.84 v252.21,239.84 | LED159.GND 235.36,239.71 v232.46,239.71 | LED158.GND 214.36,239.71 v211.46,239.71 | LED137.GND 216.25,212.25 v216,212 | LED136.GND 237.25,212.25 v237,212 | LED135.GND 257.25,212.25 v257,212 | LED134.GND 279.25,212.25 v279,212 | LED133.GND 294.25,218.75 v294,219 | LED157.GND 194.31,239.84 v191.33,239.84 | LED156.GND 173.36,239.71 v170.33,239.71 | LED155.GND 152.36,239.71 v149.21,239.71 | LED154.GND 130.36,239.71 129.24,239.71 128.6,240.35 v128.6,240.48 | LED153.GND 108,240.15 v108,242 | LED142.GND 110.25,212.25 v110,212 | LED141.GND 132.25,212.25 v132,212 | LED140.GND 154.25,212.25 v154,212 | LED139.GND 175.25,212.25 v175,212 | LED138.GND 196.25,212.25 v196,212 | LED152.GND 85,240.15 v85,242 | LED143.GND 89.25,212.25 v89,212 | LED144.GND 67.73,212.25 v67.48,212 | LED151.GND 67,240.15 v67,242 | LED145.GND 45.71,212.25 v45.46,212 | LED150.GND 45,241.15 v45,242 | LED149.GND 24,240.15 v24,242 | LED146.GND 24.22,212.25 v23.97,212 | LED147.GND 3.85,221 v2,221 | v3,242 2.4,241.4 LED148.GND
  Bottom 0.508: LED12.GND 229.42,10.69 v229.21,10.9 | v296.86,16.27 296.86,15.29 LED15.GND | v109.68,35.25 LED23.GND | LED22.GND 134.56,35.25 v134.63,35.17 | LED19.GND 216.25,24.25 v216,24 | v142.33,26.48 LED7.GND | v82.11,12.43 83.7,12.43 LED5.GND | v86.83,29.14 86.83,28.03 LED6.GND | v149.19,13.4 151.66,13.4 LED8.GND | LED24.GND 83.48,35.08 v83.48,33.65
  pour Top (isolate 0.305): 305,5 305,239 arc90 300,244 5,244 arc90 0,239 0,5 arc90 5,0 300,0 arc90
N$1
  Bottom 0.254: LED2.DIN 18.12,13.25 16.62,14.75 LED1.DOUT
N$2
  Bottom 0.254: LED2.DOUT 35.78,14.75 37.28,13.25 LED3.DIN
N$3
  Bottom 0.254: LED3.DOUT 55.97,14.75 61.54,9.19 LED4.DIN
N$4
  Bottom 0.254: LED5.DIN 85.56,11.01 85.23,10.69 LED4.DOUT
N$5
  Bottom 0.254: LED6.DIN 85.86,26.05 84.06,24.24 LED5.DOUT
N$6
  Bottom 0.254: LED6.DOUT 92.52,29.2 94.94,31.62 135,31.62 138.95,27.67 LED7.DIN
N$7
  Top 0.254: U1.A5 125.43,20.79 124.71,20.07 119.24,20.07 R3.1
N$8
  Bottom 0.254: LED8.DOUT 172.31,13.34 LED9.DIN
N$9
  Bottom 0.254: LED9.DOUT 182.08,14.75 183.58,13.25 LED10.DIN
N$10
  Bottom 0.254: LED10.DOUT 202.78,14.75 204.28,13.25 LED11.DIN
N$11
  Bottom 0.254: LED11.DOUT 221.2,14.75 226.76,9.19 LED12.DIN
N$12
  Bottom 0.254: LED12.DOUT 246.49,10.69 249.05,13.25 LED13.DIN
N$13
  Bottom 0.254: LED13.DOUT 262.86,14.75 264.36,13.25 LED14.DIN
N$14
  Bottom 0.254: LED15.DIN 286.47,13.25 284.97,14.75 LED14.DOUT
N$15
  Bottom 0.254: LED16.DIN 300.75,23.35 302.6,21.5 LED15.DOUT
N$16
  Bottom 0.254: LED16.DOUT 294.28,32.6 289.08,27.4 LED17.DIN
N$17
  Bottom 0.254: LED17.DOUT 271.68,32.6 266.48,27.4 LED18.DIN
N$18
  Bottom 0.254: LED19.DIN 222.79,27.4 224.54,29.15 224.54,32.54 228,36 250,36 252.25,33.75 LED18.DOUT
N$19
  Bottom 0.254: LED19.DOUT 209.32,32.6 204.12,27.4 LED20.DIN
N$20
  Bottom 0.254: LED20.DOUT 187.22,32.6 182.02,27.4 LED21.DIN
N$21
  Bottom 0.254: LED21.DOUT 169.25,36.35 167.62,37.97 132.82,37.97 LED22.DIN
N$22
  Bottom 0.254: LED22.DOUT 118.67,35.25 117.17,36.75 LED23.DIN
N$23
  Bottom 0.254: LED24.DIN 87.37,36.84 88.96,35.25 LED23.DOUT
N$24
  Bottom 0.254: LED25.DIN 50.83,27.4 60.43,37 72.86,37 74.52,35.34 LED24.DOUT
N$25
  Bottom 0.254: LED25.DOUT 42.57,32.6 37.37,27.4 LED26.DIN
N$26
  Bottom 0.254: LED26.DOUT 20.73,32.6 15.53,27.4 LED27.DIN
N$27
  Bottom 0.254: LED28.DOUT 15.27,49.75 16.77,48.25 LED29.DIN
N$28
  Bottom 0.254: LED29.DOUT 34.2,49.75 35.7,48.25 LED30.DIN
N$29
  Bottom 0.254: LED30.DOUT 55.53,49.75 57.03,48.25 LED31.DIN
N$30
  Bottom 0.254: LED31.DOUT 77.12,49.75 78.62,48.25 LED32.DIN
N$31
  Top 0.203: R1.1 100.8,18.43 101.68,19.3 107.14,19.3 109.15,21.31 U2.B5
N$32
  Bottom 0.254: LED32.DOUT 99.22,49.75 100.72,48.25 LED33.DIN
N$33
  Top 0.203: R2.1 99.78,20.05 105.35,20.05 106.15,20.85 U2.A5
N$34
  Bottom 0.254: LED33.DOUT 118.91,49.75 120.41,48.25 LED34.DIN
N$35
  Bottom 0.254: LED34.DOUT 142.27,49.75 143.77,48.25 LED35.DIN
N$36
  Bottom 0.254: LED35.DOUT 164.25,49.75 165.75,48.25 LED36.DIN
N$37
  Bottom 0.254: LED36.DOUT 184.69,49.75 186.19,48.25 LED37.DIN
N$38
  Bottom 0.254: LED37.DOUT 205.01,49.75 206.51,48.25 LED38.DIN
N$39
  Bottom 0.254: LED38.DOUT 225.46,49.75 226.96,48.25 LED39.DIN
N$40
  Bottom 0.254: LED39.DOUT 246.54,49.75 248.04,48.25 LED40.DIN
N$41
  Bottom 0.254: LED40.DOUT 266.99,49.75 268.49,48.25 LED41.DIN
N$42
  Bottom 0.254: LED41.DOUT 288.96,49.75 290.46,48.25 LED42.DIN
N$43
  Bottom 0.254: LED42.DOUT 302.6,58.4 301.75,59.25 LED43.DIN
N$44
  Bottom 0.254: LED27.DOUT 2.4,34.45 2.4,47.25 LED28.DIN
N$45
  Bottom 0.254: LED54.DOUT 50.9,68.25 LED55.DIN
N$46
  Bottom 0.254: LED43.DOUT 294.6,71.6 292.4,69.4 LED44.DIN
N$47
  Bottom 0.254: LED44.DOUT 274.6,74.6 269.4,69.4 LED45.DIN
N$48
  Bottom 0.254: LED45.DOUT 251.6,74.6 246.4,69.4 LED46.DIN
N$49
  Bottom 0.254: LED46.DOUT 231.6,74.6 226.4,69.4 LED47.DIN
N$50
  Bottom 0.254: LED47.DOUT 212.6,74.6 207.4,69.4 LED48.DIN
N$51
  Bottom 0.254: LED48.DOUT 189.6,74.6 184.4,69.4 LED49.DIN
N$52
  Bottom 0.254: LED49.DOUT 169.6,74.6 164.4,69.4 LED50.DIN
N$53
  Bottom 0.254: LED50.DOUT 149.6,74.6 144.4,69.4 LED51.DIN
N$54
  Bottom 0.254: LED52.DIN 127.8,69.75 129.27,71.22 129.27,73.15 130.72,74.6 LED51.DOUT
N$55
  Bottom 0.254: LED52.DOUT 100.75,68.25 99.25,69.75 LED53.DIN
N$56
  Bottom 0.254: LED53.DOUT 81.75,68.25 80.25,69.75 LED54.DIN
N$57
  Bottom 0.254: LED55.DOUT 44.6,74.6 39.4,69.4 LED56.DIN
N$58
  Bottom 0.254: LED56.DOUT 24.6,74.6 19.4,69.4 LED57.DIN
N$59
  Bottom 0.254: LED58.DOUT 12.25,96.75 13.75,95.25 LED59.DIN
N$60
  Bottom 0.254: LED59.DOUT 34.25,96.75 35.75,95.25 LED60.DIN
N$61
  Bottom 0.254: LED60.DOUT 58.25,96.75 59.75,95.25 LED61.DIN
N$62
  Bottom 0.254: LED61.DOUT 77.25,96.75 78.75,95.25 LED62.DIN
N$63
  Bottom 0.254: LED62.DOUT 98.25,96.75 99.75,95.25 LED63.DIN
N$64
  Bottom 0.254: LED63.DOUT 118.25,96.75 119.75,95.25 LED64.DIN
N$65
  Bottom 0.254: LED64.DOUT 141.25,96.75 142.75,95.25 LED65.DIN
N$66
  Bottom 0.254: LED65.DOUT 164.25,96.75 165.75,95.25 LED66.DIN
N$67
  Bottom 0.254: LED66.DOUT 185.25,96.75 186.75,95.25 LED67.DIN
N$68
  Bottom 0.254: LED67.DOUT 205.25,96.75 206.75,95.25 LED68.DIN
N$69
  Bottom 0.254: LED68.DOUT 227.25,96.75 228.75,95.25 LED69.DIN
N$70
  Bottom 0.254: LED69.DOUT 245.25,96.75 246.75,95.25 LED70.DIN
N$71
  Bottom 0.254: LED70.DOUT 266.25,96.75 267.75,95.25 LED71.DIN
N$72
  Bottom 0.254: LED71.DOUT 290.25,96.75 291.75,95.25 LED72.DIN
N$73
  Bottom 0.254: LED57.DOUT 2.4,76.45 LED58.DIN
N$74
  Bottom 0.254: LED73.DOUT 294.6,122.6 289.4,117.4 LED74.DIN
N$75
  Bottom 0.254: LED74.DOUT 273.6,122.6 268.4,117.4 LED75.DIN
N$76
  Bottom 0.254: LED75.DOUT 252.6,122.6 247.4,117.4 LED76.DIN
N$77
  Bottom 0.254: LED76.DOUT 232.6,122.6 227.4,117.4 LED77.DIN
N$78
  Bottom 0.254: LED77.DOUT 209.6,122.6 204.4,117.4 LED78.DIN
N$79
  Bottom 0.254: LED78.DOUT 188.6,122.6 183.4,117.4 LED79.DIN
N$80
  Bottom 0.254: LED79.DOUT 172.6,122.6 167.4,117.4 LED80.DIN
N$81
  Bottom 0.254: LED80.DOUT 149.6,122.6 144.4,117.4 LED81.DIN
N$82
  Bottom 0.254: LED81.DOUT 126.6,122.6 121.4,117.4 LED82.DIN
N$83
  Bottom 0.254: LED82.DOUT 103.6,122.6 98.4,117.4 LED83.DIN
N$84
  Bottom 0.254: LED83.DOUT 82.6,122.6 77.4,117.4 LED84.DIN
N$85
  Bottom 0.254: LED84.DOUT 64.6,122.6 59.4,117.4 LED85.DIN
N$86
  Bottom 0.254: LED85.DOUT 41.6,122.6 36.4,117.4 LED86.DIN
N$87
  Bottom 0.254: LED86.DOUT 20.6,122.6 15.4,117.4 LED87.DIN
N$88
  Bottom 0.254: LED72.DOUT 302.6,111.4 300.75,113.25 LED73.DIN
N$89
  Bottom 0.254: LED88.DOUT 14.25,144.75 15.75,143.25 LED89.DIN
N$90
  Bottom 0.254: LED89.DOUT 35.25,144.75 36.75,143.25 LED90.DIN
N$91
  Bottom 0.254: LED90.DOUT 57.25,144.75 58.75,143.25 LED91.DIN
N$92
  Bottom 0.254: LED91.DOUT 77.25,144.75 78.75,143.25 LED92.DIN
N$93
  Bottom 0.254: LED92.DOUT 98.25,144.75 99.75,143.25 LED93.DIN
N$94
  Bottom 0.254: LED93.DOUT 120.25,144.75 121.75,143.25 LED94.DIN
N$95
  Bottom 0.254: LED94.DOUT 143.25,144.75 144.75,143.25 LED95.DIN
N$96
  Bottom 0.254: LED95.DOUT 164.25,144.75 165.75,143.25 LED96.DIN
N$97
  Bottom 0.254: LED96.DOUT 184.25,144.75 185.75,143.25 LED97.DIN
N$98
  Bottom 0.254: LED97.DOUT 204.25,144.75 205.75,143.25 LED98.DIN
N$99
  Bottom 0.254: LED98.DOUT 226.25,144.75 227.75,143.25 LED99.DIN
N$100
  Bottom 0.254: LED99.DOUT 246.25,144.75 247.75,143.25 LED100.DIN
N$101
  Bottom 0.254: LED100.DOUT 267.25,144.75 268.75,143.25 LED101.DIN
N$102
  Bottom 0.254: LED101.DOUT 289.25,144.75 290.75,143.25 LED102.DIN
N$103
  Bottom 0.254: LED87.DOUT 2.4,124.45 LED88.DIN
N$104
  Bottom 0.254: LED103.DOUT 295.6,170.6 290.4,165.4 LED104.DIN
N$105
  Bottom 0.254: LED104.DOUT 276.6,170.6 271.4,165.4 LED105.DIN
N$106
  Bottom 0.254: LED105.DOUT 252.6,170.6 247.4,165.4 LED106.DIN
N$107
  Bottom 0.254: LED106.DOUT 231.6,170.6 226.4,165.4 LED107.DIN
N$108
  Bottom 0.254: LED107.DOUT 209.6,170.6 204.4,165.4 LED108.DIN
N$109
  Bottom 0.254: LED108.DOUT 190.6,170.6 185.4,165.4 LED109.DIN
N$110
  Bottom 0.254: LED109.DOUT 169.6,170.6 164.4,165.4 LED110.DIN
N$111
  Bottom 0.254: LED110.DOUT 147.6,170.6 142.4,165.4 LED111.DIN
N$112
  Bottom 0.254: LED111.DOUT 122.6,170.6 117.4,165.4 LED112.DIN
N$113
  Bottom 0.254: LED112.DOUT 104.6,170.6 99.4,165.4 LED113.DIN
N$114
  Bottom 0.254: LED113.DOUT 84.6,170.6 79.4,165.4 LED114.DIN
N$115
  Bottom 0.254: LED114.DOUT 64.6,170.6 59.4,165.4 LED115.DIN
N$116
  Bottom 0.254: LED115.DOUT 39.6,170.6 34.4,165.4 LED116.DIN
N$117
  Bottom 0.254: LED116.DOUT 18.6,170.6 13.4,165.4 LED117.DIN
N$118
  Bottom 0.254: LED102.DOUT 302.6,157.4 300.75,159.25 LED103.DIN
N$119
  Bottom 0.254: LED118.DOUT 13.25,193.75 14.75,192.25 LED119.DIN
N$120
  Bottom 0.254: LED119.DOUT 36.25,193.75 37.75,192.25 LED120.DIN
N$121
  Bottom 0.254: LED120.DOUT 56.25,193.75 57.75,192.25 LED121.DIN
N$122
  Bottom 0.254: LED121.DOUT 77.25,193.75 78.75,192.25 LED122.DIN
N$123
  Bottom 0.254: LED122.DOUT 99.25,193.75 100.75,192.25 LED123.DIN
N$124
  Bottom 0.254: LED123.DOUT 120.25,193.75 121.75,192.25 LED124.DIN
N$125
  Bottom 0.254: LED124.DOUT 140.25,193.75 141.75,192.25 LED125.DIN
N$126
  Bottom 0.254: LED125.DOUT 163.25,193.75 164.75,192.25 LED126.DIN
N$127
  Bottom 0.254: LED126.DOUT 185.25,193.75 186.75,192.25 LED127.DIN
N$128
  Bottom 0.254: LED127.DOUT 205.25,193.75 206.75,192.25 LED128.DIN
N$129
  Bottom 0.254: LED128.DOUT 225.25,193.75 226.75,192.25 LED129.DIN
N$130
  Bottom 0.254: LED129.DOUT 246.25,193.75 247.75,192.25 LED130.DIN
N$131
  Bottom 0.254: LED130.DOUT 266.25,193.75 267.75,192.25 LED131.DIN
N$132
  Bottom 0.254: LED131.DOUT 293.36,193.75 294.86,192.25 LED132.DIN
N$133
  Bottom 0.254: LED117.DOUT 2.4,172.45 LED118.DIN
N$134
  Bottom 0.254: LED133.DOUT 302.6,220.4 302,221 292,221 286.4,215.4 LED134.DIN
N$135
  Bottom 0.254: LED134.DOUT 274.6,220.6 269.4,215.4 LED135.DIN
N$136
  Bottom 0.254: LED135.DOUT 250.6,220.6 245.4,215.4 LED136.DIN
N$137
  Bottom 0.254: LED136.DOUT 232.6,220.6 227.4,215.4 LED137.DIN
N$138
  Bottom 0.254: LED137.DOUT 210.6,220.6 205.4,215.4 LED138.DIN
N$139
  Bottom 0.254: LED138.DOUT 189.6,220.6 184.4,215.4 LED139.DIN
N$140
  Bottom 0.254: LED139.DOUT 170.6,220.6 165.4,215.4 LED140.DIN
N$141
  Bottom 0.254: LED140.DOUT 149.6,220.6 144.4,215.4 LED141.DIN
N$142
  Bottom 0.254: LED141.DOUT 126.6,220.6 121.4,215.4 LED142.DIN
N$143
  Bottom 0.254: LED142.DOUT 103.6,220.6 98.4,215.4 LED143.DIN
N$144
  Bottom 0.254: LED143.DOUT 80.08,220.6 74.88,215.4 LED144.DIN
N$145
  Bottom 0.254: LED144.DOUT 62.08,220.6 56.88,215.4 LED145.DIN
N$146
  Bottom 0.254: LED145.DOUT 41.06,220.6 35.86,215.4 LED146.DIN
N$147
  Bottom 0.254: LED146.DOUT 23.42,221.4 LED147.DIN
N$148
  Bottom 0.254: LED132.DOUT 302.6,197.43 292,208.03 292,213.35 295.9,217.25 LED133.DIN
N$149
  Bottom 0.254: LED148.DOUT 18.66,239.75 20.16,238.25 LED149.DIN
N$150
  Bottom 0.254: LED149.DOUT 35.25,239.75 36.75,238.25 LED150.DIN
N$151
  Bottom 0.254: LED150.DOUT 56.25,239.75 57.75,238.25 LED151.DIN
N$152
  Bottom 0.254: LED151.DOUT 79.25,239.75 80.75,238.25 LED152.DIN
N$153
  Bottom 0.254: LED152.DOUT 99.25,239.75 101,238 108.15,238 LED153.DIN
N$154
  Bottom 0.254: LED153.DOUT 119.25,239.75 120.75,238.25 LED154.DIN
N$155
  Bottom 0.254: LED154.DOUT 145.25,239.75 146.75,238.25 LED155.DIN
N$156
  Bottom 0.254: LED155.DOUT 163.25,239.75 164.75,238.25 LED156.DIN
N$157
  Bottom 0.254: LED156.DOUT 185.25,239.75 186.75,238.25 LED157.DIN
N$158
  Bottom 0.254: LED157.DOUT 205.25,239.75 206.75,238.25 LED158.DIN
N$159
  Bottom 0.254: LED158.DOUT 226.25,239.75 227.75,238.25 LED159.DIN
N$160
  Bottom 0.254: LED159.DOUT 247.25,239.75 248.75,238.25 LED160.DIN
N$161
  Bottom 0.254: LED160.DOUT 268.25,239.75 269.75,238.25 LED161.DIN
N$162
  Bottom 0.254: LED161.DOUT 288.25,239.75 289.75,238.25 LED162.DIN
N$163
  Bottom 0.254: LED147.DOUT 2.4,228.45 LED148.DIN
N$164
  Top 0.254: U1.B5 128.43,20.48 127.25,19.3 120.78,19.3 119.9,18.43 R4.1
N$165
  Top 0.203: U2.A6 107.15,21.46 107.4,21.21 107.9,21.21 108.15,21.45 U2.B6 108.15,27.44 JP1.3
  Bottom 0.254: LED1.DIN 2.4,11.19 3.17,10.41 11.56,10.41 12.83,11.68 19.3,11.68 26.16,4.83 89.79,4.83 96.65,11.68 96.65,17.27 99.31,19.94 105.28,19.94 108.08,22.73 108.08,27.37 JP1.3
N$166
  Top 0.203: U2.A7 107.65,24.13 107.4,24.38 106.65,24.38 | JP1.2 106.65,27.44 106.65,24.38 | 106.65,24.38 U2.B7
N$167
  Top 0.254: JP2.3 127.43,27.48 127.43,24.89 | 127.43,24.89 U1.B6 | U1.A6 126.43,24.45 126.87,24.89 127.43,24.89
N$168  (via drill 0.5)
  Top 0.254: U1.A7 126.93,21.14 126.75,20.95 126.24,20.95 125.93,21.26 U1.B7 125.93,27.61 JP2.2 125.79,28.38 125.79,66.88 128.76,69.85 128.76,91.95 126.11,94.6 126.11,240.16 128.02,242.06 v299.59,242.06
  Bottom 0.254: LED162.DOUT 302.6,241.15 301.69,242.06 v299.59,242.06
N$169
  Bottom 0.254: LED7.DOUT 140.45,16.14 144.75,11.84 LED8.DIN
N$170
  Top 0.254: LED163.C R9.2

### Text on the board
tNames: GND | DI | 5V | GND | DO | 5V | Pimp my Beeb / ATX RGB Adaptor Plate / dekuNukem SEPT 2022 | PWR